# Altium project BEE-1012 PAY-EXP_V100.PrjPcb (part 4 of 4)

## Sheet 17_FLOW_Sensor.SchDoc
size 420 x 297 mm; SheetNumber: 26; SheetTotal: 33
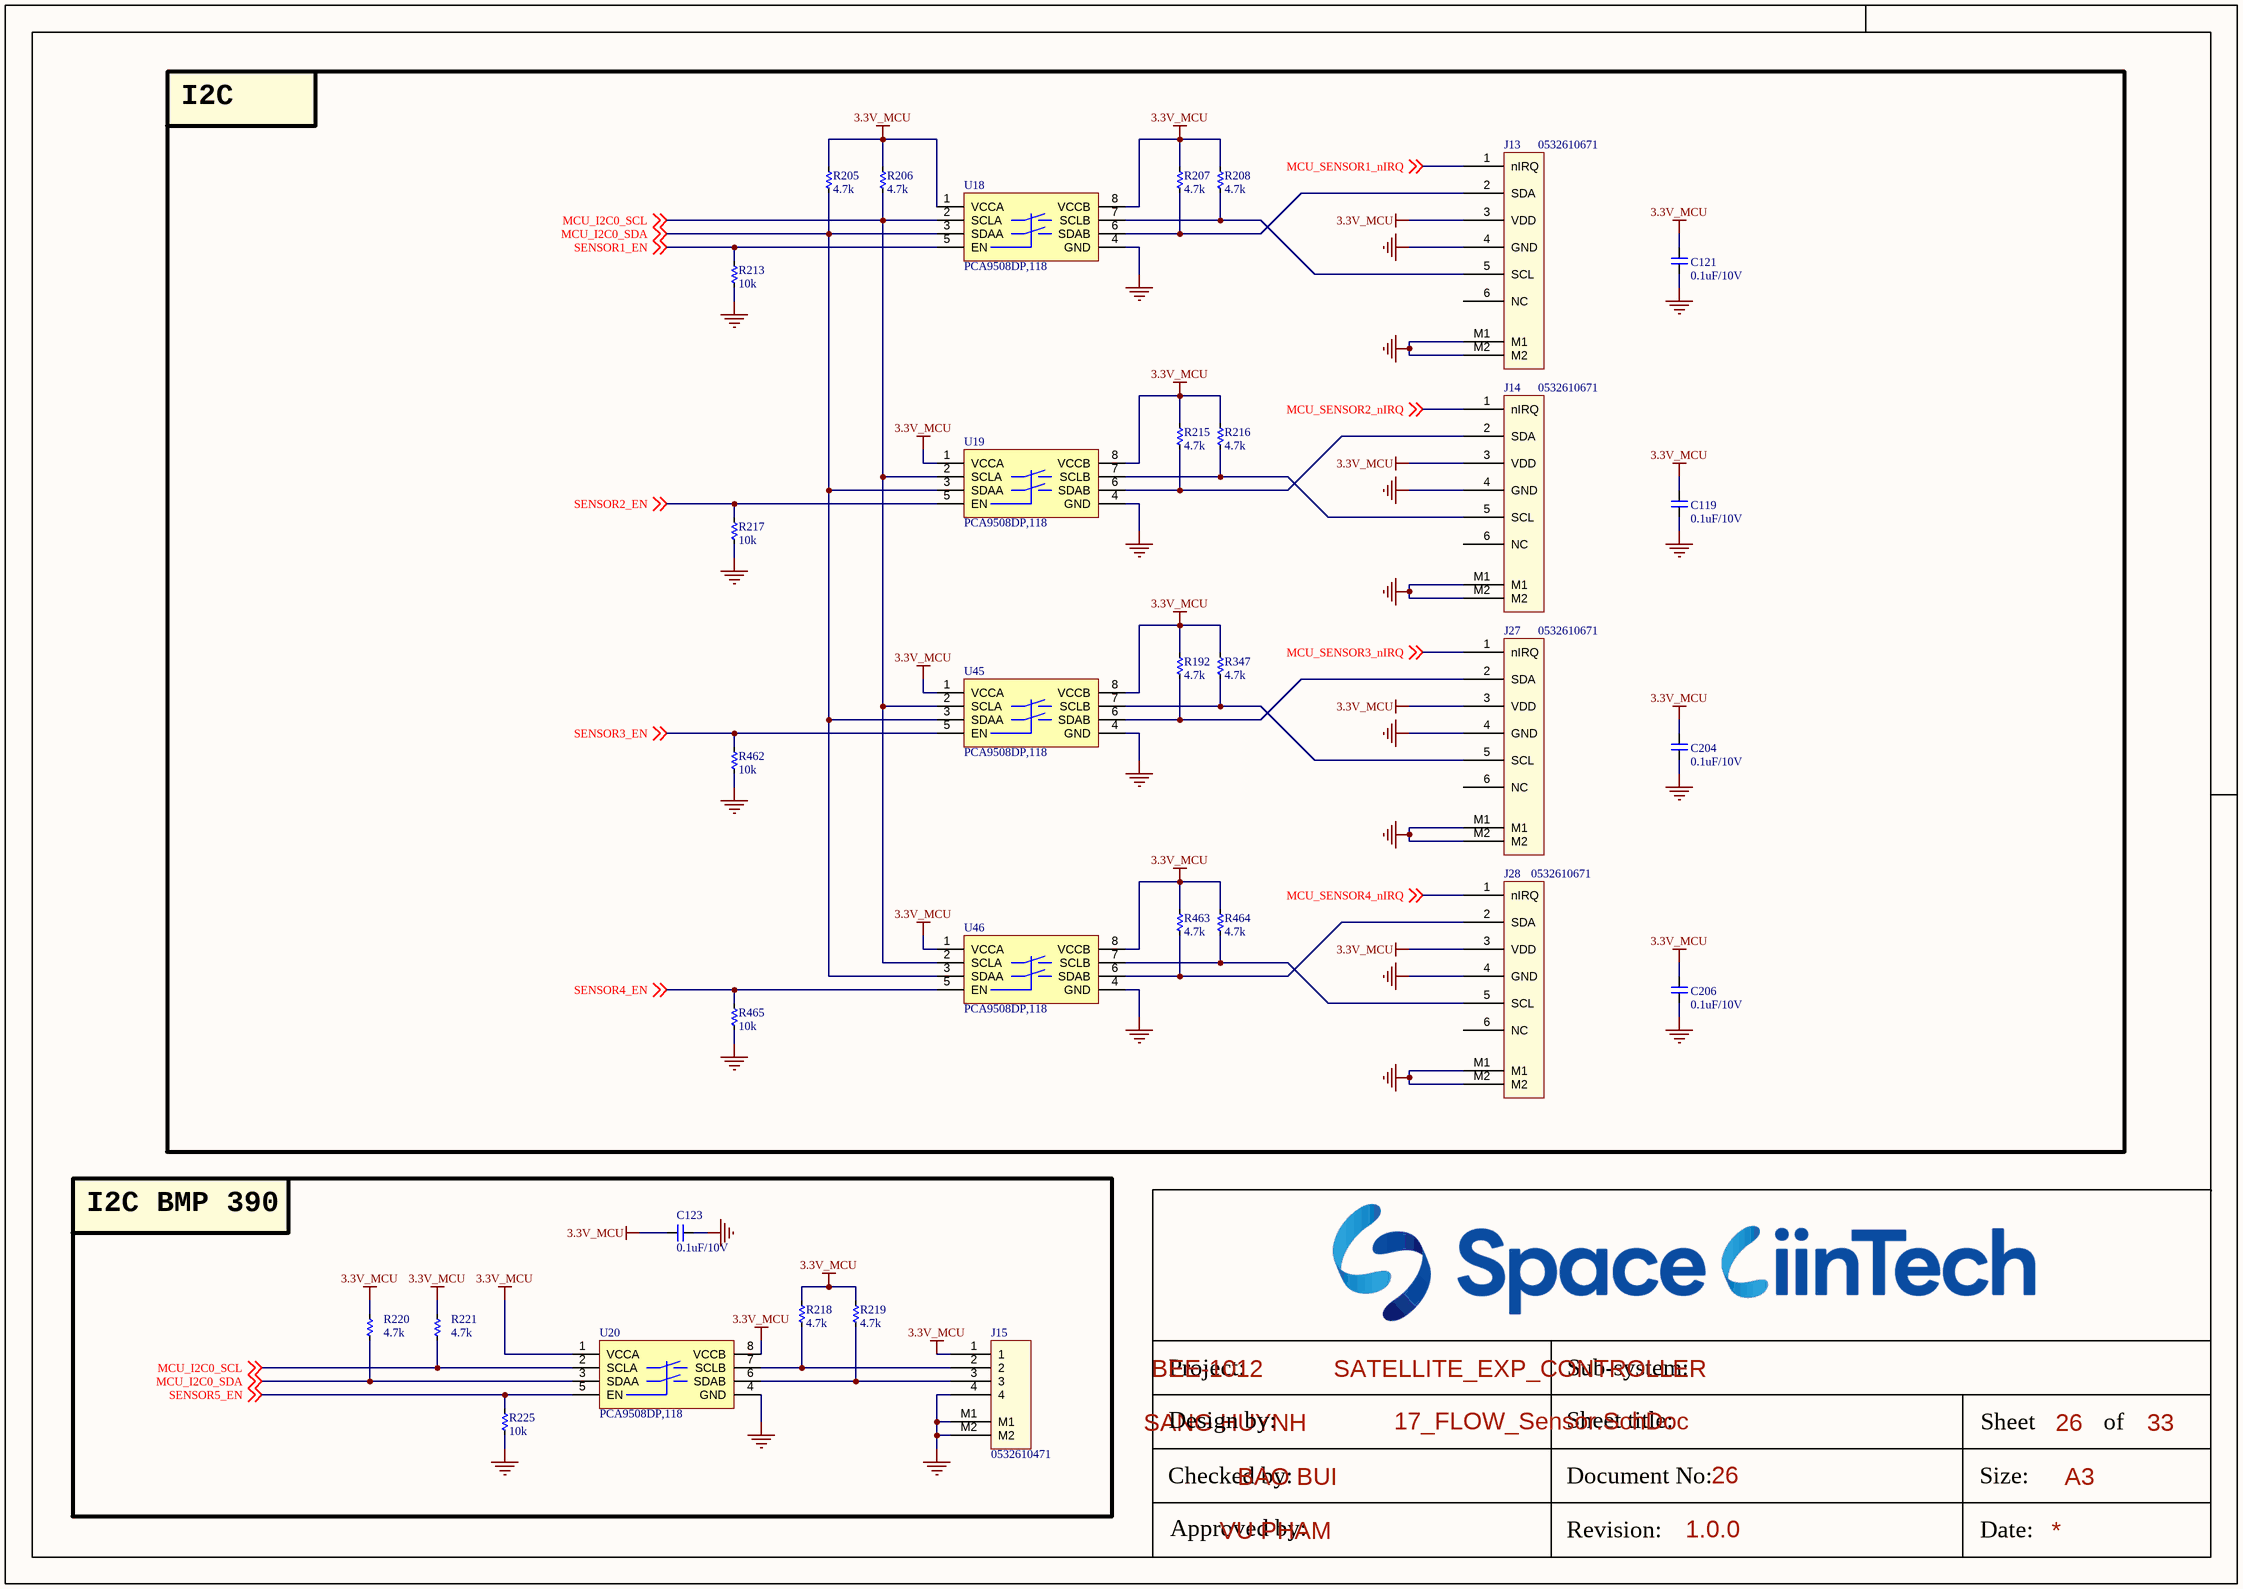
[diagram p30: 17_FLOW_Sensor.SchDoc]

### Parts
(Parts that share a designator on the sheet are numbered #1, #2 ... from top to bottom, then left to right.)
C119  0.1uF/10V  [CAP_C_1005X50_L]
C121  0.1uF/10V  [CAP_C_1005X50_L]
C123  0.1uF/10V  [CAP_C_1005X50_L]
C204  0.1uF/10V  [CAP_C_1005X50_L]
C206  0.1uF/10V  [CAP_C_1005X50_L]
J13  0532610671  [MOLEX_0532610671]
J14  0532610671  [MOLEX_0532610671]
J15  0532610471  [MOLEX_0532610471]
J27  0532610671  [MOLEX_0532610671]
J28  0532610671  [MOLEX_0532610671]
R192#2  4.7k  [RES_C_1005x30_L]
R205#2  4.7k  [RES_C_1005x30_L]
R206  4.7k  [RES_C_1005x30_L]
R207  4.7k  [RES_C_1005x30_L]
R208  4.7k  [RES_C_1005x30_L]
R213  10k  [RES_C_1005x30_L]
R215  4.7k  [RES_C_1005x30_L]
R216  4.7k  [RES_C_1005x30_L]
R217  10k  [RES_C_1005x30_L]
R218  4.7k  [RES_C_1005x30_L]
R219  4.7k  [RES_C_1005x30_L]
R220  4.7k  [RES_C_1005x30_L]
R221  4.7k  [RES_C_1005x30_L]
R225  10k  [RES_C_1005x30_L]
R347  4.7k  [RES_C_1005x30_L]
R462  10k  [RES_C_1005x30_L]
R463  4.7k  [RES_C_1005x30_L]
R464  4.7k  [RES_C_1005x30_L]
R465  10k  [RES_C_1005x30_L]
U18  PCA9508DP,118  [TSOP8]
U19  PCA9508DP,118  [TSOP8]
U20  PCA9508DP,118  [TSOP8]
U45  PCA9508DP,118  [TSOP8]
U46  PCA9508DP,118  [TSOP8]

### Blocks framed on the sheet
I2C: C119 C121 C204 C206 J13 J14 J27 J28 R192#2 R205#2 R206-R208 R213 R215-R217 R347 R462-R465 U18 U19 U45 U46
I2C BMP 390: C123 J15 R218-R221 R225 U20

### Nets
3.3V_MCU: C119.2 C121.2 C123.2 C204.2 C206.2 J13.3(VDD) J14.3(VDD) J15.1 J27.3(VDD) J28.3(VDD) R192#2.1 R205#2.1 R206.1 R207.1 R208.1 R215.1 R216.1 R218.1 R219.1 R220.1 R221.1 R347.1 R463.1 R464.1 U18.1(VCCA) U18.8(VCCB) U19.1(VCCA) U19.8(VCCB) U20.1(VCCA) U20.8(VCCB) U45.1(VCCA) U45.8(VCCB) U46.1(VCCA) U46.8(VCCB)
GND: C119.1 C121.1 C123.1 C204.1 C206.1 J13.4(GND) J13.M1 J13.M2 J14.4(GND) J14.M1 J14.M2 J15.4 J15.M1 J15.M2 J27.4(GND) J27.M1 J27.M2 J28.4(GND) J28.M1 J28.M2 R213.2 R217.2 R225.2 R462.2 R465.2 U18.4(GND) U19.4(GND) U20.4(GND) U45.4(GND) U46.4(GND)
MCU_I2C0_SCL: R206.2 R221.2 U18.2(SCLA) U19.2(SCLA) U20.2(SCLA) U45.2(SCLA) U46.2(SCLA) ; off-sheet MCU_I2C0_SCL
MCU_I2C0_SDA: R205#2.2 R220.2 U18.3(SDAA) U19.3(SDAA) U20.3(SDAA) U45.3(SDAA) U46.3(SDAA) ; off-sheet MCU_I2C0_SDA
MCU_SENSOR1_nIRQ: J13.1(nIRQ) ; off-sheet MCU_SENSOR1_nIRQ
MCU_SENSOR2_nIRQ: J14.1(nIRQ) ; off-sheet MCU_SENSOR2_nIRQ
MCU_SENSOR3_nIRQ: J27.1(nIRQ) ; off-sheet MCU_SENSOR3_nIRQ
MCU_SENSOR4_nIRQ: J28.1(nIRQ) ; off-sheet MCU_SENSOR4_nIRQ
SENSOR1_EN: R213.1 U18.5(EN) ; off-sheet SENSOR1_EN
SENSOR2_EN: R217.1 U19.5(EN) ; off-sheet SENSOR2_EN
SENSOR3_EN: R462.1 U45.5(EN) ; off-sheet SENSOR3_EN
SENSOR4_EN: R465.1 U46.5(EN) ; off-sheet SENSOR4_EN
SENSOR5_EN: R225.1 U20.5(EN) ; off-sheet SENSOR5_EN
NetJ13_2: J13.2(SDA) R207.2 U18.6(SDAB)
NetJ13_5: J13.5(SCL) R208.2 U18.7(SCLB)
NetJ14_2: J14.2(SDA) R215.2 U19.6(SDAB)
NetJ14_5: J14.5(SCL) R216.2 U19.7(SCLB)
NetJ15_2: J15.2 R218.2 U20.7(SCLB)
NetJ15_3: J15.3 R219.2 U20.6(SDAB)
NetJ27_2: J27.2(SDA) R192#2.2 U45.6(SDAB)
NetJ27_5: J27.5(SCL) R347.2 U45.7(SCLB)
NetJ28_2: J28.2(SDA) R463.2 U46.6(SDAB)
NetJ28_5: J28.5(SCL) R464.2 U46.7(SCLB)

Not connected (* = marked no-connect by the designer): J13 6(NC); J14 6(NC); J27 6(NC); J28 6(NC)

### Notes on the sheet
- Project:
- BEE-1012
- Sub-system:
- SATELLITE_EXP_CONTROLLER
- Design by:
- SANG HUYNH
- BAO BUI
- Sheet title:
- Sheet
- A3
- of
- Checked by:
- Approved by:
- VU PHAM
- Revision:
- Document No:
- Size:
- Date:

### Library data of the parts
C119 C121 C123 C204 C206 = _CAP_C_2: CAP
J13 J14 J27 J28 = FLOW_SENSOR
J15 = Header 4x1_2M
R192#2 R205#2 R206-R208 R213 R215-R221 R225 R347 R462-R465 = _RES_B_2: RES

## Sheet 17_I2C_Sensor_OnBoard.SchDoc
size 420 x 297 mm; SheetNumber: 27; SheetTotal: 33
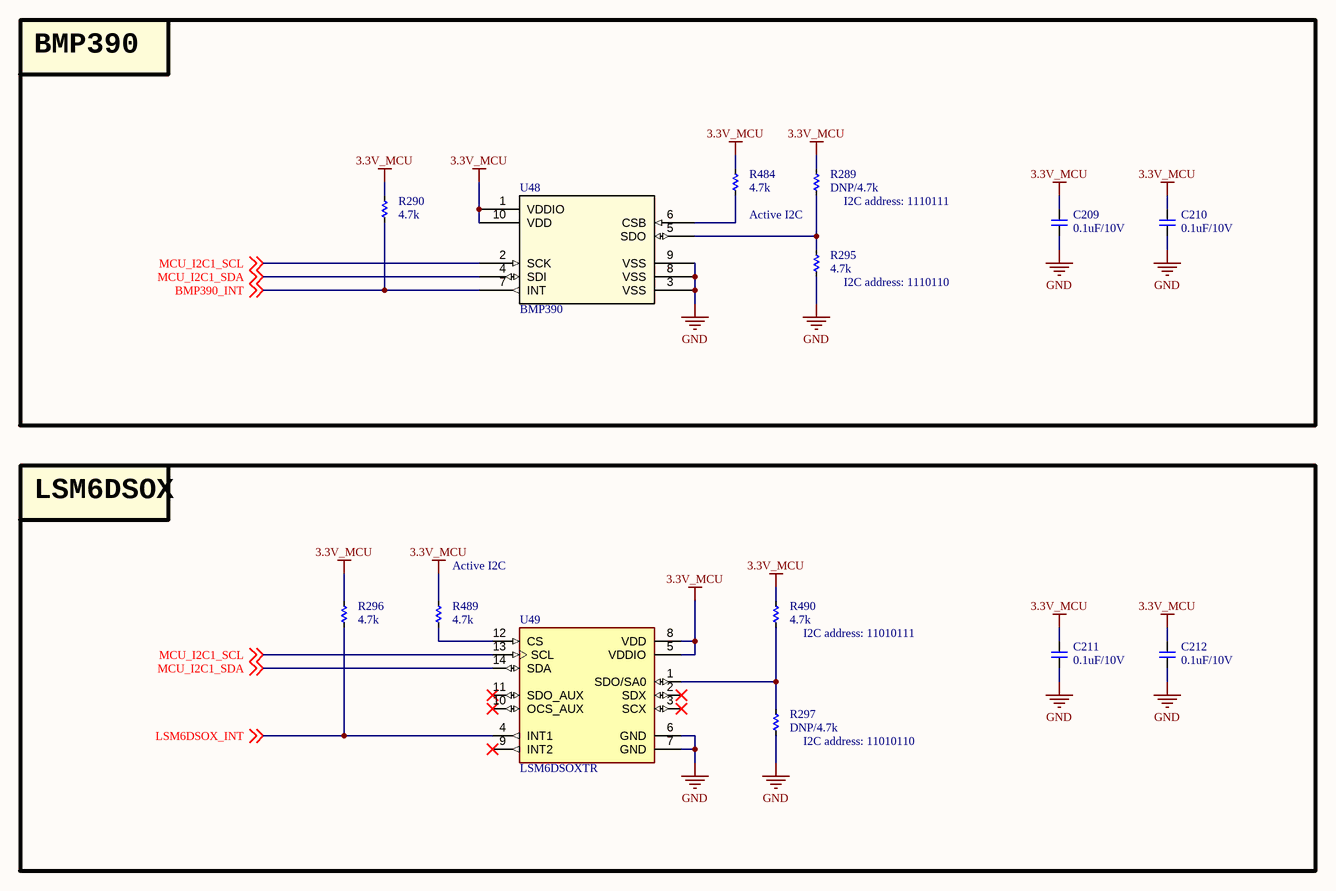
[diagram p31: 17_I2C_Sensor_OnBoard.SchDoc]

### Parts
C209  0.1uF/10V  [CAP_C_1005X50_L]
C210  0.1uF/10V  [CAP_C_1005X50_L]
C211  0.1uF/10V  [CAP_C_1005X50_L]
C212  0.1uF/10V  [CAP_C_1005X50_L]
R289  DNP/4.7k  [RES_C_1005x30_L]
R290  4.7k  [RES_C_0603X30]
R295  4.7k  [RES_C_1005x30_L]
R296  4.7k  [RES_C_1005x30_L]
R297  DNP/4.7k  [RES_C_1005x30_L]
R484  4.7k  [RES_C_1005x30_L]
R489  4.7k  [RES_C_1005x30_L]
R490  4.7k  [RES_C_1005x30_L]
U48  BMP390  [10LGA_2X2X0p75_BOS]
U49  LSM6DSOXTR  [PQFN50P250X300X86-14N]

### Blocks framed on the sheet
BMP390: C209 C210 R289 R290 R295 R484 U48
LSM6DSOX: C211 C212 R296 R297 R489 R490 U49

### Nets
3.3V_MCU: C209.2 C210.2 C211.2 C212.2 R289.1 R290.1 R296.1 R484.1 R489.1 R490.1 U48.1(VDDIO) U48.10(VDD) U49.5(VDDIO) U49.8(VDD)
GND: C209.1 C210.1 C211.1 C212.1 R295.2 R297.2 U48.3(VSS) U48.8(VSS) U48.9(VSS) U49.6(GND) U49.7(GND)
BMP390_INT: R290.2 U48.7(INT) ; off-sheet BMP390_INT
LSM6DSOX_INT: R296.2 U49.4(INT1) ; off-sheet LSM6DSOX_INT
MCU_I2C1_SCL: U48.2(SCK) U49.13(SCL) ; off-sheet MCU_I2C1_SCL
MCU_I2C1_SDA: U48.4(SDI) U49.14(SDA) ; off-sheet MCU_I2C1_SDA
NetR289_2: R289.2 R295.1 U48.5(SDO)
NetR297_1: R297.1 R490.2 U49.1(SDO/SA0)
NetR484_2: R484.2 U48.6(CSB)
NetR489_2: R489.2 U49.12(CS)

Not connected (* = marked no-connect by the designer): U49 2(SDX)* 3(SCX)* 9(INT2)* 10(OCS_AUX)* 11(SDO_AUX)*

### Notes on the sheet
- Active I2C
- (near R289) I2C address: 1110111
- (near R295) I2C address: 1110110
- (near R489) Active I2C
- (near R490) I2C address: 11010111
- (near R297) I2C address: 11010110
- Project:
- BEE-1012
- Sub-system:
- SATELLITE_EXP_CONTROLLER
- Design by:
- SANG HUYNH
- BAO BUI
- Sheet title:
- Sheet
- A3
- of
- Checked by:
- Approved by:
- VU PHAM
- Revision:
- Document No:
- Size:
- Date:

### Library data of the parts
C209-C212 = _CAP_C_2: CAP
R289 R290 R295-R297 R484 R489 R490 = _RES_B_2: RES
U48 = BMP390: Description; Manufacturer_Name: Bosch Sensortec; Copyright: Copyright (C) 2025 Ultra Librarian. All rights reserved.; Manufacturer_Part_Number: BMP390; RefDes: RefDes; Type: Type
U49 = LSM6DSOXTR: Accelerometer, Gyroscope, 6 Axis Sensor I2C, SPI Output; MF: STMicroelectronics; SnapEDA_Link: https://www.snapeda.com/parts/LSM6DSOXTR/STMicroelectronics/view-part/?ref=snap; Package: VFLGA-14 STMicroelectronics; Value: *; MP: LSM6DSOXTR; Check_prices: https://www.snapeda.com/parts/LSM6DSOXTR/STMicroelectronics/view-part/?ref=eda

## Sheet 18_HD4_PUMP.SchDoc
size 420 x 297 mm; SheetNumber: 28; SheetTotal: 33
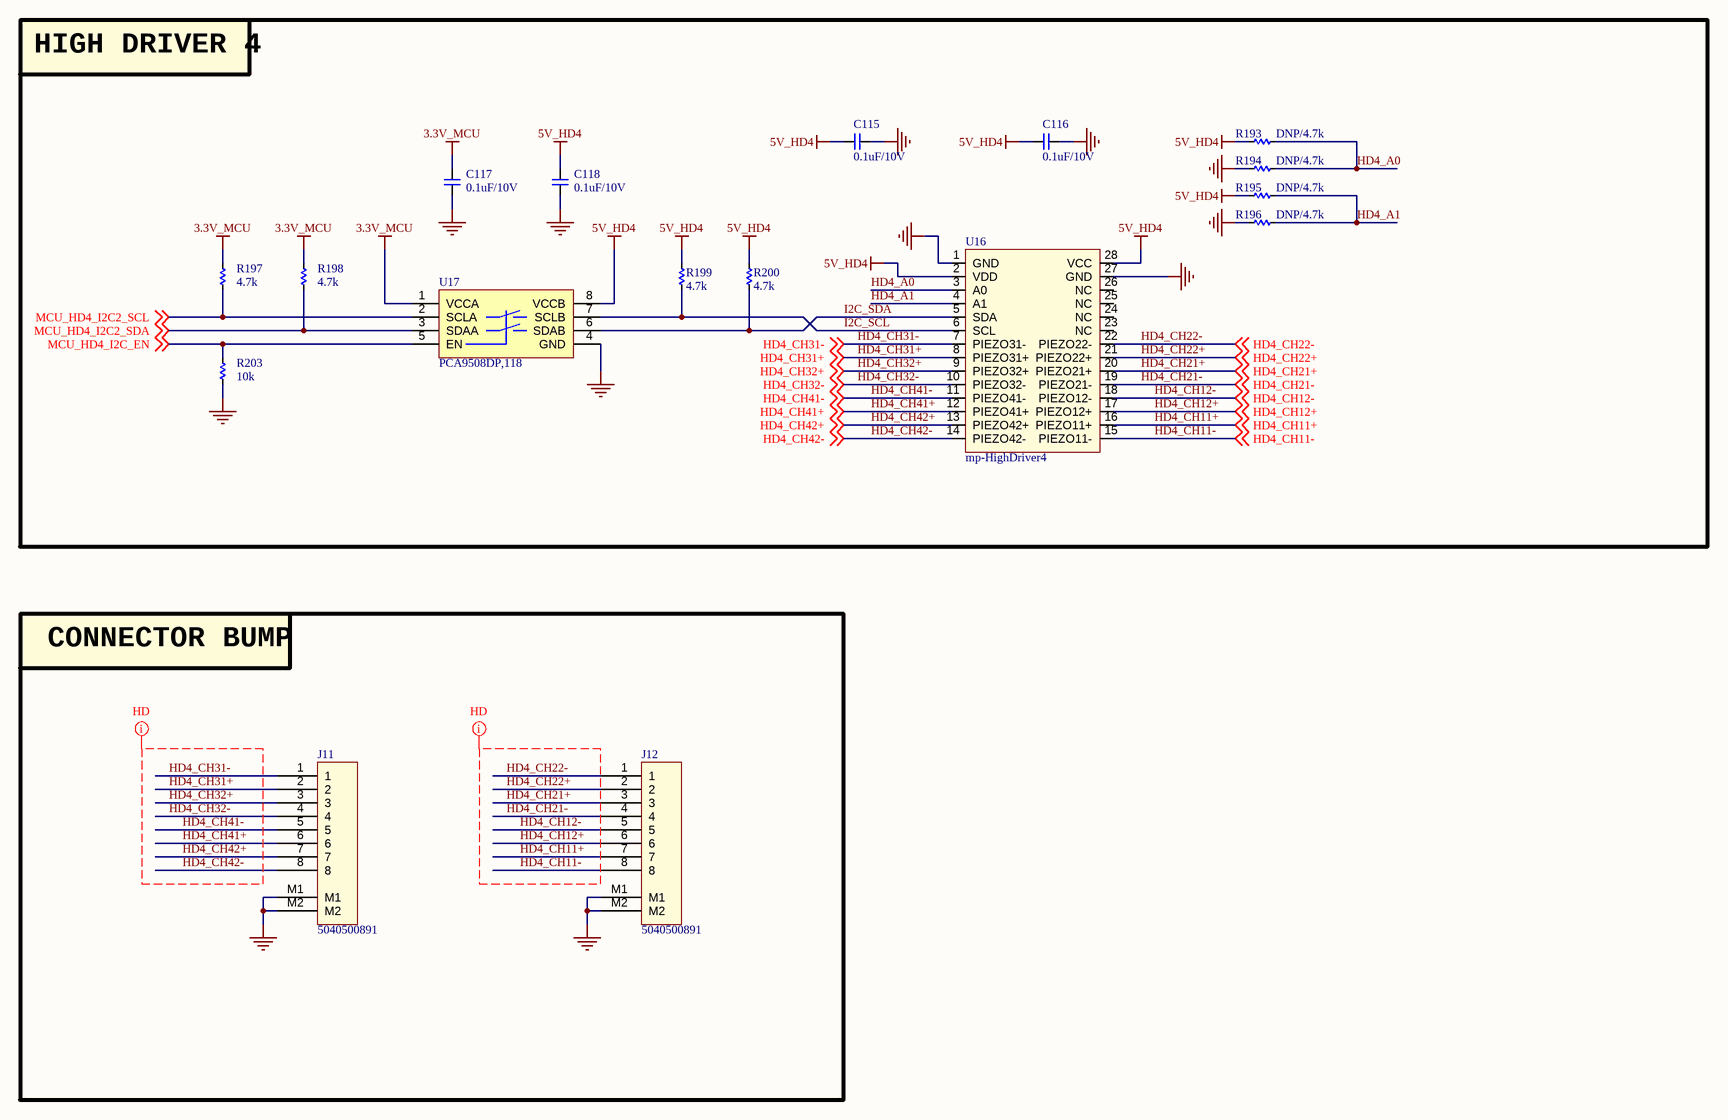
[diagram p32: 18_HD4_PUMP.SchDoc]

### Parts
(Parts that share a designator on the sheet are numbered #1, #2 ... from top to bottom, then left to right.)
C115  0.1uF/10V  [CAP_C_1005X50_L]
C116  0.1uF/10V  [CAP_C_1005X50_L]
C117  0.1uF/10V  [CAP_C_1005X50_L]
C118  0.1uF/10V  [CAP_C_1005X50_L]
J11  5040500891  [MOLEX_5040500891]
J12  5040500891  [MOLEX_5040500891]
R193#2  DNP/4.7k  [RES_C_1005x30_L]
R194#2  DNP/4.7k  [RES_C_1005x30_L]
R195#2  DNP/4.7k  [RES_C_1005x30_L]
R196#2  DNP/4.7k  [RES_C_1005x30_L]
R197#2  4.7k  [RES_C_1005x30_L]
R198#2  4.7k  [RES_C_1005x30_L]
R199#2  4.7k  [RES_C_1005x30_L]
R200#2  4.7k  [RES_C_1005x30_L]
R203#2  10k  [RES_C_1005x30_L]
U16  mp-HighDriver4  [MP_HIGHDRIVER4]
U17  PCA9508DP,118  [TSOP8]

### Blocks framed on the sheet
HIGH DRIVER 4: C115-C118 R193#2 R194#2 R195#2 R196#2 R197#2 R198#2 R199#2 R200#2 R203#2 U16 U17
CONNECTOR BUMP: J11 J12

### Nets
3.3V_MCU: C117.2 R197#2.1 R198#2.1 U17.1(VCCA)
5V_HD4: C115.2 C116.2 C118.2 R193#2.1 R195#2.1 R199#2.1 R200#2.1 U16.2(VDD) U16.28(VCC) U17.8(VCCB)
GND: C115.1 C116.1 C117.1 C118.1 J11.M1 J11.M2 J12.M1 J12.M2 R194#2.1 R196#2.1 R203#2.2 U16.1(GND) U16.27(GND) U17.4(GND)
HD4_A0: R193#2.2 R194#2.2 U16.3(A0)
HD4_A1: R195#2.2 R196#2.2 U16.4(A1)
HD4_CH11+: J12.7 U16.16(PIEZO11+) ; off-sheet HD4_CH11+
HD4_CH11-: J12.8 U16.15(PIEZO11-) ; off-sheet HD4_CH11-
HD4_CH12+: J12.6 U16.17(PIEZO12+) ; off-sheet HD4_CH12+
HD4_CH12-: J12.5 U16.18(PIEZO12-) ; off-sheet HD4_CH12-
HD4_CH21+: J12.3 U16.20(PIEZO21+) ; off-sheet HD4_CH21+
HD4_CH21-: J12.4 U16.19(PIEZO21-) ; off-sheet HD4_CH21-
HD4_CH22+: J12.2 U16.21(PIEZO22+) ; off-sheet HD4_CH22+
HD4_CH22-: J12.1 U16.22(PIEZO22-) ; off-sheet HD4_CH22-
HD4_CH31+: J11.2 U16.8(PIEZO31+) ; off-sheet HD4_CH31+
HD4_CH31-: J11.1 U16.7(PIEZO31-) ; off-sheet HD4_CH31-
HD4_CH32+: J11.3 U16.9(PIEZO32+) ; off-sheet HD4_CH32+
HD4_CH32-: J11.4 U16.10(PIEZO32-) ; off-sheet HD4_CH32-
HD4_CH41+: J11.6 U16.12(PIEZO41+) ; off-sheet HD4_CH41+
HD4_CH41-: J11.5 U16.11(PIEZO41-) ; off-sheet HD4_CH41-
HD4_CH42+: J11.7 U16.13(PIEZO42+) ; off-sheet HD4_CH42+
HD4_CH42-: J11.8 U16.14(PIEZO42-) ; off-sheet HD4_CH42-
I2C_SCL: R199#2.2 U16.6(SCL) U17.7(SCLB)
I2C_SDA: R200#2.2 U16.5(SDA) U17.6(SDAB)
MCU_HD4_I2C2_SCL: R197#2.2 U17.2(SCLA) ; off-sheet MCU_HD4_I2C2_SCL
MCU_HD4_I2C2_SDA: R198#2.2 U17.3(SDAA) ; off-sheet MCU_HD4_I2C2_SDA
MCU_HD4_I2C_EN: R203#2.1 U17.5(EN) ; off-sheet MCU_HD4_I2C_EN

Not connected (* = marked no-connect by the designer): U16 23(NC) 24(NC) 25(NC) 26(NC)

### Layout directives
net class HD: HD4_CH11+, HD4_CH11-, HD4_CH12+, HD4_CH12-, HD4_CH21+, HD4_CH21-, HD4_CH22+, HD4_CH22-, HD4_CH31+, HD4_CH31-, HD4_CH32+, HD4_CH32-, HD4_CH41+, HD4_CH41-, HD4_CH42+, HD4_CH42-

### Notes on the sheet
- Project:
- BEE-1012
- Sub-system:
- SATELLITE_EXP_CONTROLLER
- Design by:
- SANG HUYNH
- BAO BUI
- Sheet title:
- Sheet
- A3
- of
- Checked by:
- Approved by:
- VU PHAM
- Revision:
- Document No:
- Size:
- Date:

### Library data of the parts
C115-C118 = _CAP_C_2: CAP
J11 J12 = Header 8x1_2M
R193#2 R194#2 R195#2 R196#2 R197#2 R198#2 R199#2 R200#2 R203#2 = _RES_B_2: RES
U16 = mp_HighDriver4

## Sheet 18_HD4_PUMP_2.SchDoc
size 420 x 297 mm; SheetNumber: 29; SheetTotal: 33
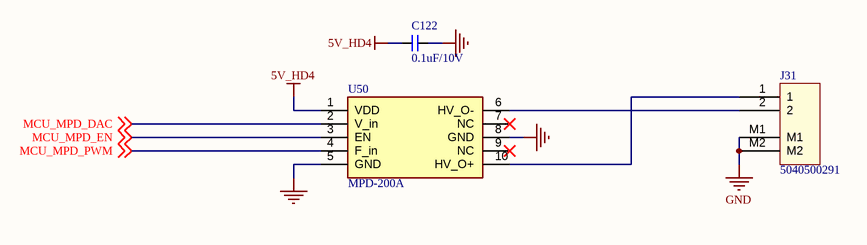
[diagram p33: 18_HD4_PUMP_2.SchDoc]

### Parts
C122  0.1uF/10V  [CAP_C_1005X50_L]
J31  5040500291  [MOLEX_5040500291]
U50  MPD-200A  [MPD-200a]

### Nets
5V_HD4: C122.2 U50.1(VDD)
GND: C122.1 J31.M1 J31.M2 U50.5(GND) U50.8(GND)
MCU_MPD_DAC: U50.2(V_in) ; off-sheet MCU_MPD_DAC
MCU_MPD_EN: U50.3(EN) ; off-sheet MCU_MPD_EN
MCU_MPD_PWM: U50.4(F_in) ; off-sheet MCU_MPD_PWM
NetJ31_1: J31.1 U50.10(HV_O+)
NetJ31_2: J31.2 U50.6(HV_O-)

Not connected (* = marked no-connect by the designer): U50 7(NC)* 9(NC)*

### Notes on the sheet
- Project:
- BEE-1012
- Sub-system:
- SATELLITE_EXP_CONTROLLER
- Design by:
- SANG HUYNH
- BAO BUI
- Sheet title:
- Sheet
- A3
- of
- Checked by:
- Approved by:
- VU PHAM
- Revision:
- Document No:
- Size:
- Date:

### Library data of the parts
C122 = _CAP_C_2: CAP
J31 = Header 2x1_2M

## Sheet 19_SOLEDNOID_1.SchDoc
size 420 x 297 mm; SheetNumber: 30; SheetTotal: 33
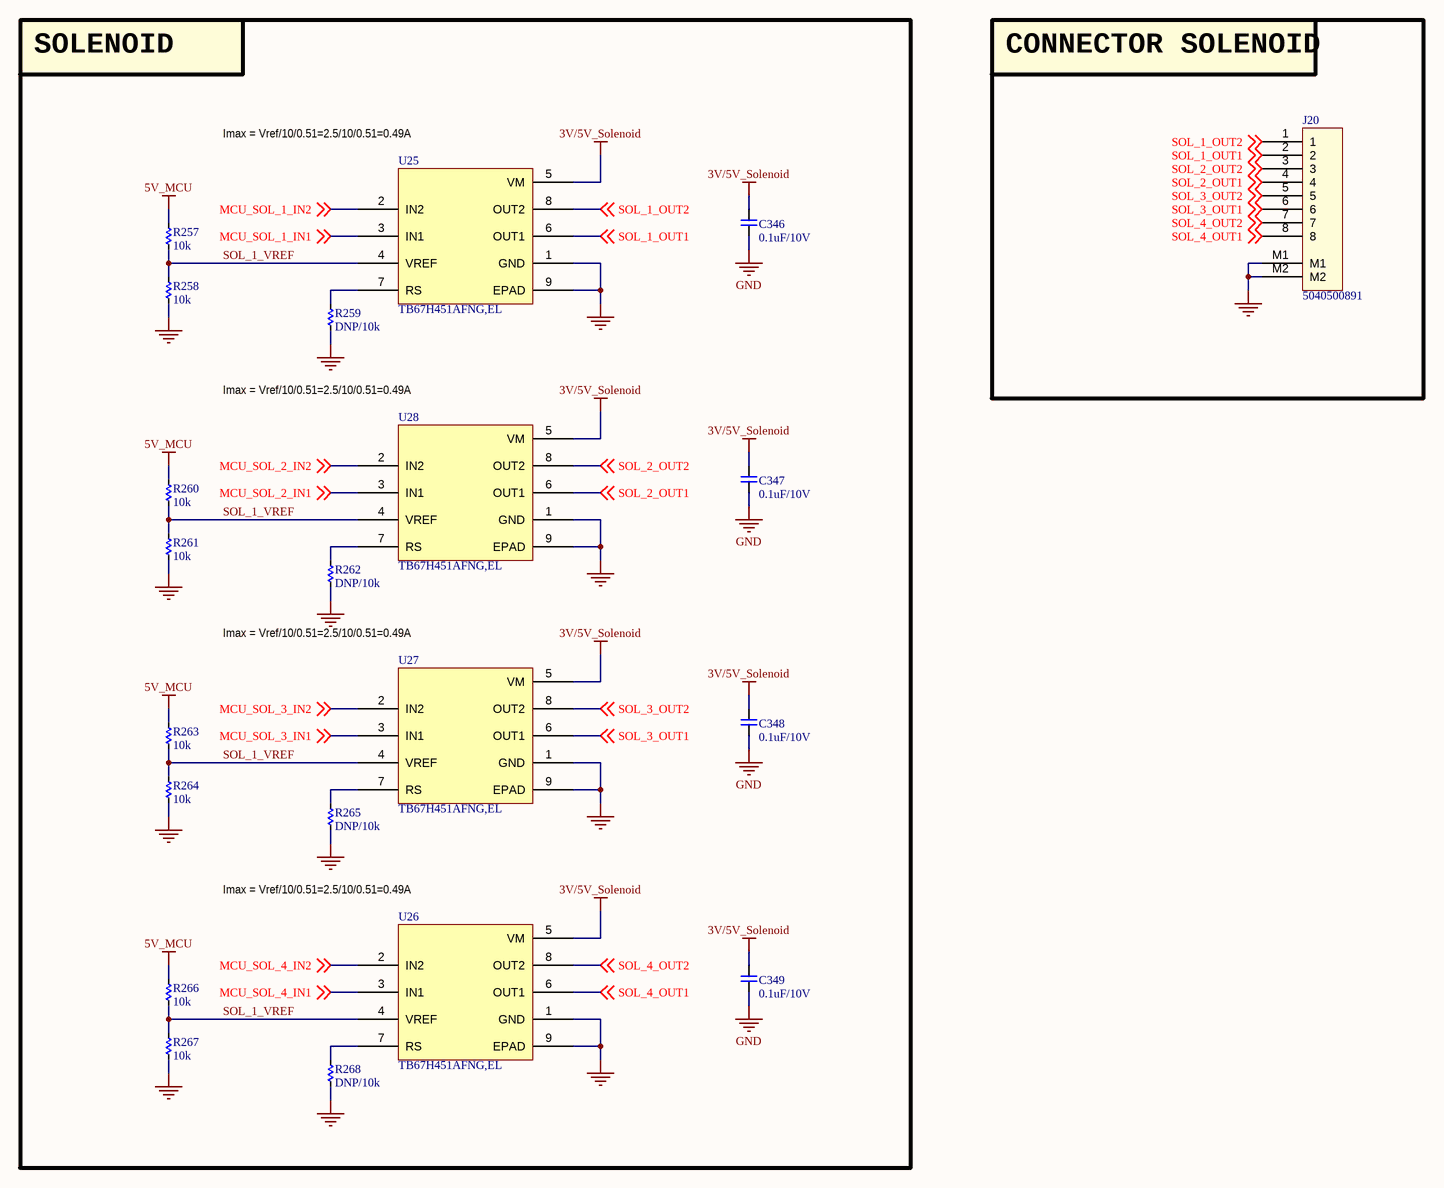
[diagram p34: 19_SOLEDNOID_1.SchDoc]

### Parts
(Parts that share a designator on the sheet are numbered #1, #2 ... from top to bottom, then left to right.)
C346  0.1uF/10V  [CAP_C_1005X50_L]
C347  0.1uF/10V  [CAP_C_1005X50_L]
C348  0.1uF/10V  [CAP_C_1005X50_L]
C349  0.1uF/10V  [CAP_C_1005X50_L]
J20  5040500891  [MOLEX_5040500891]
R257  10k  [RES_C_1005x30_L]
R258  10k  [RES_C_1005x30_L]
R259  DNP/10k  [RES_C_1005x30_L]
R260  10k  [RES_C_1005x30_L]
R261  10k  [RES_C_1005x30_L]
R262  DNP/10k  [RES_C_1005x30_L]
R263  10k  [RES_C_1005x30_L]
R264  10k  [RES_C_1005x30_L]
R265  DNP/10k  [RES_C_1005x30_L]
R266  10k  [RES_C_1005x30_L]
R267  10k  [RES_C_1005x30_L]
R268  DNP/10k  [RES_C_1005x30_L]
U25#2  TB67H451AFNG,EL  [SOIC127P602X173-8N_EPAD]
U26#2  TB67H451AFNG,EL  [SOIC127P602X173-8N_EPAD]
U27#2  TB67H451AFNG,EL  [SOIC127P602X173-8N_EPAD]
U28#2  TB67H451AFNG,EL  [SOIC127P602X173-8N_EPAD]

### Blocks framed on the sheet
SOLENOID: C346-C349 R257-R268 U25#2 U26#2 U27#2 U28#2
CONNECTOR SOLENOID: J20

### Nets
3V/5V_Solenoid: C346.2 C347.2 C348.2 C349.2 U25#2.5(VM) U26#2.5(VM) U27#2.5(VM) U28#2.5(VM)
5V_MCU: R257.1 R260.1 R263.1 R266.1
GND: C346.1 C347.1 C348.1 C349.1 J20.M1 J20.M2 R258.2 R259.2 R261.2 R262.2 R264.2 R265.2 R267.2 R268.2 U25#2.1(GND) U25#2.9(EPAD) U26#2.1(GND) U26#2.9(EPAD) U27#2.1(GND) U27#2.9(EPAD) U28#2.1(GND) U28#2.9(EPAD)
MCU_SOL_1_IN1: U25#2.3(IN1) ; off-sheet MCU_SOL_1_IN1
MCU_SOL_1_IN2: U25#2.2(IN2) ; off-sheet MCU_SOL_1_IN2
MCU_SOL_2_IN1: U28#2.3(IN1) ; off-sheet MCU_SOL_2_IN1
MCU_SOL_2_IN2: U28#2.2(IN2) ; off-sheet MCU_SOL_2_IN2
MCU_SOL_3_IN1: U27#2.3(IN1) ; off-sheet MCU_SOL_3_IN1
MCU_SOL_3_IN2: U27#2.2(IN2) ; off-sheet MCU_SOL_3_IN2
MCU_SOL_4_IN1: U26#2.3(IN1) ; off-sheet MCU_SOL_4_IN1
MCU_SOL_4_IN2: U26#2.2(IN2) ; off-sheet MCU_SOL_4_IN2
SOL_1_OUT1: J20.2 U25#2.6(OUT1) ; off-sheet SOL_1_OUT1
SOL_1_OUT2: J20.1 U25#2.8(OUT2) ; off-sheet SOL_1_OUT2
SOL_1_VREF: R257.2 R258.1 R260.2 R261.1 R263.2 R264.1 R266.2 R267.1 U25#2.4(VREF) U26#2.4(VREF) U27#2.4(VREF) U28#2.4(VREF)
SOL_2_OUT1: J20.4 U28#2.6(OUT1) ; off-sheet SOL_2_OUT1
SOL_2_OUT2: J20.3 U28#2.8(OUT2) ; off-sheet SOL_2_OUT2
SOL_3_OUT1: J20.6 U27#2.6(OUT1) ; off-sheet SOL_3_OUT1
SOL_3_OUT2: J20.5 U27#2.8(OUT2) ; off-sheet SOL_3_OUT2
SOL_4_OUT1: J20.8 U26#2.6(OUT1) ; off-sheet SOL_4_OUT1
SOL_4_OUT2: J20.7 U26#2.8(OUT2) ; off-sheet SOL_4_OUT2
NetR259_1: R259.1 U25#2.7(RS)
NetR262_1: R262.1 U28#2.7(RS)
NetR265_1: R265.1 U27#2.7(RS)
NetR268_1: R268.1 U26#2.7(RS)

### Notes on the sheet
- (near U25#2) Imax = Vref/10/0.51=2.5/10/0.51=0.49A
- Imax = Vref/10/0.51=2.5/10/0.51=0.49A
- Project:
- BEE-1012
- Sub-system:
- SATELLITE_EXP_CONTROLLER
- Design by:
- SANG HUYNH
- BAO BUI
- Sheet title:
- Sheet
- A3
- of
- Checked by:
- Approved by:
- VU PHAM
- Revision:
- Document No:
- Size:
- Date:

### Library data of the parts
C346-C349 = _CAP_C_2: CAP CHIP
J20 = Header 8x1_2M
R257-R268 = _RES_B_2: RES
U25#2 U26#2 U27#2 U28#2 = IC_H_bridge_TB67H451AFNG,EL: BRUSHED MOTOR DRIVER IC, 50V, 3.

## Sheet 19_SOLEDNOID_2.SchDoc
size 420 x 297 mm; SheetNumber: 31; SheetTotal: 33
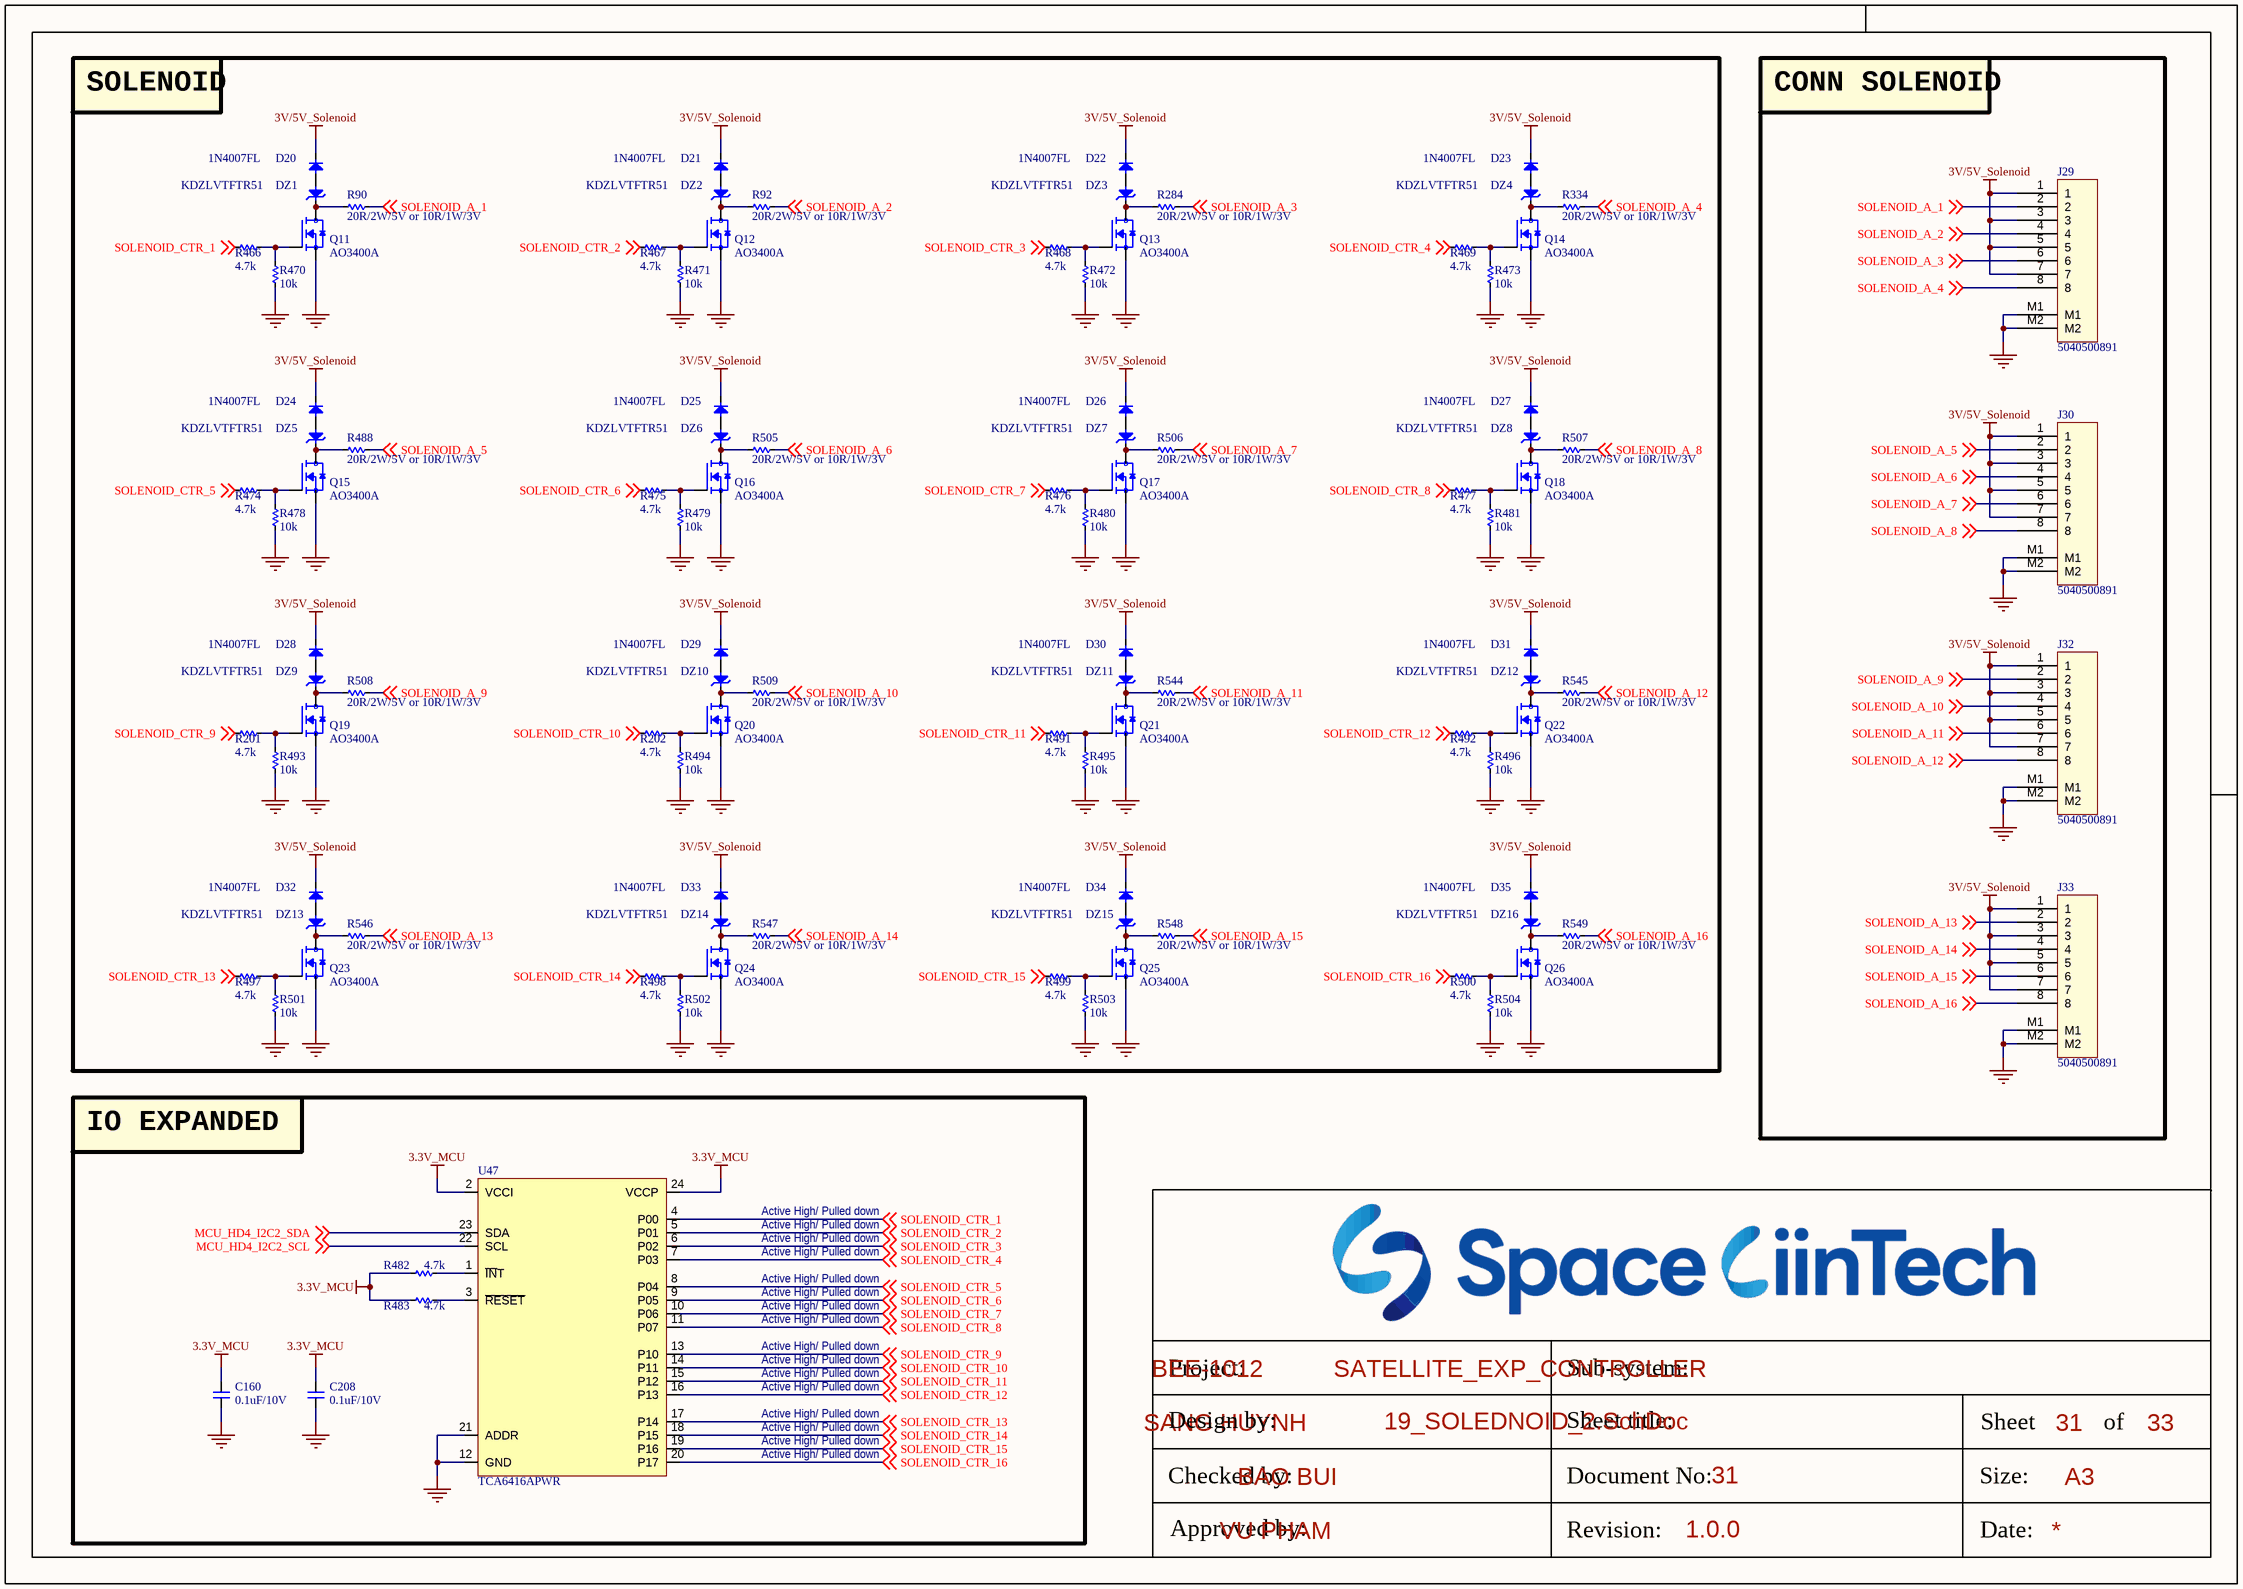
[diagram p35: 19_SOLEDNOID_2.SchDoc]

### Parts
(Parts that share a designator on the sheet are numbered #1, #2 ... from top to bottom, then left to right.)
C160#2  0.1uF/10V  [CAP_C_1005X50_L]
C208  0.1uF/10V  [CAP_C_1005X50_L]
D20  1N4007FL  [SOD3717X145N]
D21  1N4007FL  [SOD3717X145N]
D22  1N4007FL  [SOD3717X145N]
D23  1N4007FL  [SOD3717X145N]
D24  1N4007FL  [SOD3717X145N]
D25  1N4007FL  [SOD3717X145N]
D26  1N4007FL  [SOD3717X145N]
D27  1N4007FL  [SOD3717X145N]
D28  1N4007FL  [SOD3717X145N]
D29  1N4007FL  [SOD3717X145N]
D30  1N4007FL  [SOD3717X145N]
D31  1N4007FL  [SOD3717X145N]
D32  1N4007FL  [SOD3717X145N]
D33  1N4007FL  [SOD3717X145N]
D34  1N4007FL  [SOD3717X145N]
D35  1N4007FL  [SOD3717X145N]
DZ1  KDZLVTFTR51  [SOD3717X145N]
DZ2  KDZLVTFTR51  [SOD3717X145N]
DZ3  KDZLVTFTR51  [SOD3717X145N]
DZ4  KDZLVTFTR51  [SOD3717X145N]
DZ5  KDZLVTFTR51  [SOD3717X145N]
DZ6  KDZLVTFTR51  [SOD3717X145N]
DZ7  KDZLVTFTR51  [SOD3717X145N]
DZ8  KDZLVTFTR51  [SOD3717X145N]
DZ9  KDZLVTFTR51  [SOD3717X145N]
DZ10  KDZLVTFTR51  [SOD3717X145N]
DZ11  KDZLVTFTR51  [SOD3717X145N]
DZ12  KDZLVTFTR51  [SOD3717X145N]
DZ13  KDZLVTFTR51  [SOD3717X145N]
DZ14  KDZLVTFTR51  [SOD3717X145N]
DZ15  KDZLVTFTR51  [SOD3717X145N]
DZ16  KDZLVTFTR51  [SOD3717X145N]
J29  5040500891  [MOLEX_5040500891]
J30  5040500891  [MOLEX_5040500891]
J32  5040500891  [MOLEX_5040500891]
J33  5040500891  [MOLEX_5040500891]
Q11  AO3400A  [SOT95P240X120-3N]
Q12  AO3400A  [SOT95P240X120-3N]
Q13  AO3400A  [SOT95P240X120-3N]
Q14  AO3400A  [SOT95P240X120-3N]
Q15  AO3400A  [SOT95P240X120-3N]
Q16  AO3400A  [SOT95P240X120-3N]
Q17  AO3400A  [SOT95P240X120-3N]
Q18  AO3400A  [SOT95P240X120-3N]
Q19  AO3400A  [SOT95P240X120-3N]
Q20  AO3400A  [SOT95P240X120-3N]
Q21  AO3400A  [SOT95P240X120-3N]
Q22  AO3400A  [SOT95P240X120-3N]
Q23  AO3400A  [SOT95P240X120-3N]
Q24  AO3400A  [SOT95P240X120-3N]
Q25  AO3400A  [SOT95P240X120-3N]
Q26  AO3400A  [SOT95P240X120-3N]
R90  20R/2W/5V or 10R/1W/3V  [RES_C_6331X65_N]
R92  20R/2W/5V or 10R/1W/3V  [RES_C_6331X65_N]
R201#2  4.7k  [RES_C_1005x30_L]
R202#2  4.7k  [RES_C_1005x30_L]
R284  20R/2W/5V or 10R/1W/3V  [RES_C_6331X65_N]
R334  20R/2W/5V or 10R/1W/3V  [RES_C_6331X65_N]
R466  4.7k  [RES_C_1005x30_L]
R467  4.7k  [RES_C_1005x30_L]
R468  4.7k  [RES_C_1005x30_L]
R469  4.7k  [RES_C_1005x30_L]
R470  10k  [RES_C_1005x30_L]
R471  10k  [RES_C_1005x30_L]
R472  10k  [RES_C_1005x30_L]
R473  10k  [RES_C_1005x30_L]
R474  4.7k  [RES_C_1005x30_L]
R475  4.7k  [RES_C_1005x30_L]
R476  4.7k  [RES_C_1005x30_L]
R477  4.7k  [RES_C_1005x30_L]
R478  10k  [RES_C_1005x30_L]
R479  10k  [RES_C_1005x30_L]
R480  10k  [RES_C_1005x30_L]
R481  10k  [RES_C_1005x30_L]
R482  4.7k  [RES_C_1005x30_L]
R483  4.7k  [RES_C_1005x30_L]
R488  20R/2W/5V or 10R/1W/3V  [RES_C_6331X65_N]
R491  4.7k  [RES_C_1005x30_L]
R492  4.7k  [RES_C_1005x30_L]
R493  10k  [RES_C_1005x30_L]
R494  10k  [RES_C_1005x30_L]
R495  10k  [RES_C_1005x30_L]
R496  10k  [RES_C_1005x30_L]
R497  4.7k  [RES_C_1005x30_L]
R498  4.7k  [RES_C_1005x30_L]
R499  4.7k  [RES_C_1005x30_L]
R500  4.7k  [RES_C_1005x30_L]
R501  10k  [RES_C_1005x30_L]
R502  10k  [RES_C_1005x30_L]
R503  10k  [RES_C_1005x30_L]
R504  10k  [RES_C_1005x30_L]
R505  20R/2W/5V or 10R/1W/3V  [RES_C_6331X65_N]
R506  20R/2W/5V or 10R/1W/3V  [RES_C_6331X65_N]
R507  20R/2W/5V or 10R/1W/3V  [RES_C_6331X65_N]
R508  20R/2W/5V or 10R/1W/3V  [RES_C_6331X65_N]
R509  20R/2W/5V or 10R/1W/3V  [RES_C_6331X65_N]
R544  20R/2W/5V or 10R/1W/3V  [RES_C_6331X65_N]
R545  20R/2W/5V or 10R/1W/3V  [RES_C_6331X65_N]
R546  20R/2W/5V or 10R/1W/3V  [RES_C_6331X65_N]
R547  20R/2W/5V or 10R/1W/3V  [RES_C_6331X65_N]
R548  20R/2W/5V or 10R/1W/3V  [RES_C_6331X65_N]
R549  20R/2W/5V or 10R/1W/3V  [RES_C_6331X65_N]
U47  TCA6416APWR  [SOP65P440W-24N]

### Blocks framed on the sheet
SOLENOID: D20-D35 DZ1-DZ16 Q11-Q26 R90 R92 R201#2 R202#2 R284 R334 R466-R481 R488 R491-R509 R544-R549
CONN SOLENOID: J29 J30 J32 J33
IO EXPANDED: C160#2 C208 R482 R483 U47

### Nets
3.3V_MCU: C160#2.2 C208.2 R482.1 R483.1 U47.2(VCCI) U47.24(VCCP)
3V/5V_Solenoid: D20.1(K) D21.1(K) D22.1(K) D23.1(K) D24.1(K) D25.1(K) D26.1(K) D27.1(K) D28.1(K) D29.1(K) D30.1(K) D31.1(K) D32.1(K) D33.1(K) D34.1(K) D35.1(K) J29.1 J29.3 J29.5 J29.7 J30.1 J30.3 J30.5 J30.7 J32.1 J32.3 J32.5 J32.7 J33.1 J33.3 J33.5 J33.7
GND: C160#2.1 C208.1 J29.M1 J29.M2 J30.M1 J30.M2 J32.M1 J32.M2 J33.M1 J33.M2 Q11.2(S) Q12.2(S) Q13.2(S) Q14.2(S) Q15.2(S) Q16.2(S) Q17.2(S) Q18.2(S) Q19.2(S) Q20.2(S) Q21.2(S) Q22.2(S) Q23.2(S) Q24.2(S) Q25.2(S) Q26.2(S) R470.1 R471.1 R472.1 R473.1 R478.1 R479.1 R480.1 R481.1 R493.1 R494.1 R495.1 R496.1 R501.1 R502.1 R503.1 R504.1 U47.12(GND) U47.21(ADDR)
MCU_HD4_I2C2_SCL: U47.22(SCL) ; off-sheet MCU_HD4_I2C2_SCL
MCU_HD4_I2C2_SDA: U47.23(SDA) ; off-sheet MCU_HD4_I2C2_SDA
SOLENOID_A_1: J29.2 R90.1 ; off-sheet SOLENOID_A_1
SOLENOID_A_2: J29.4 R92.1 ; off-sheet SOLENOID_A_2
SOLENOID_A_3: J29.6 R284.1 ; off-sheet SOLENOID_A_3
SOLENOID_A_4: J29.8 R334.1 ; off-sheet SOLENOID_A_4
SOLENOID_A_5: J30.2 R488.1 ; off-sheet SOLENOID_A_5
SOLENOID_A_6: J30.4 R505.1 ; off-sheet SOLENOID_A_6
SOLENOID_A_7: J30.6 R506.1 ; off-sheet SOLENOID_A_7
SOLENOID_A_8: J30.8 R507.1 ; off-sheet SOLENOID_A_8
SOLENOID_A_9: J32.2 R508.1 ; off-sheet SOLENOID_A_9
SOLENOID_A_10: J32.4 R509.1 ; off-sheet SOLENOID_A_10
SOLENOID_A_11: J32.6 R544.1 ; off-sheet SOLENOID_A_11
SOLENOID_A_12: J32.8 R545.1 ; off-sheet SOLENOID_A_12
SOLENOID_A_13: J33.2 R546.1 ; off-sheet SOLENOID_A_13
SOLENOID_A_14: J33.4 R547.1 ; off-sheet SOLENOID_A_14
SOLENOID_A_15: J33.6 R548.1 ; off-sheet SOLENOID_A_15
SOLENOID_A_16: J33.8 R549.1 ; off-sheet SOLENOID_A_16
SOLENOID_CTR_1: R466.2 U47.4(P00) ; off-sheet SOLENOID_CTR_1
SOLENOID_CTR_2: R467.2 U47.5(P01) ; off-sheet SOLENOID_CTR_2
SOLENOID_CTR_3: R468.2 U47.6(P02) ; off-sheet SOLENOID_CTR_3
SOLENOID_CTR_4: R469.2 U47.7(P03) ; off-sheet SOLENOID_CTR_4
SOLENOID_CTR_5: R474.2 U47.8(P04) ; off-sheet SOLENOID_CTR_5
SOLENOID_CTR_6: R475.2 U47.9(P05) ; off-sheet SOLENOID_CTR_6
SOLENOID_CTR_7: R476.2 U47.10(P06) ; off-sheet SOLENOID_CTR_7
SOLENOID_CTR_8: R477.2 U47.11(P07) ; off-sheet SOLENOID_CTR_8
SOLENOID_CTR_9: R201#2.2 U47.13(P10) ; off-sheet SOLENOID_CTR_9
SOLENOID_CTR_10: R202#2.2 U47.14(P11) ; off-sheet SOLENOID_CTR_10
SOLENOID_CTR_11: R491.2 U47.15(P12) ; off-sheet SOLENOID_CTR_11
SOLENOID_CTR_12: R492.2 U47.16(P13) ; off-sheet SOLENOID_CTR_12
SOLENOID_CTR_13: R497.2 U47.17(P14) ; off-sheet SOLENOID_CTR_13
SOLENOID_CTR_14: R498.2 U47.18(P15) ; off-sheet SOLENOID_CTR_14
SOLENOID_CTR_15: R499.2 U47.19(P16) ; off-sheet SOLENOID_CTR_15
SOLENOID_CTR_16: R500.2 U47.20(P17) ; off-sheet SOLENOID_CTR_16
NetD20_2: D20.2(A) DZ1.2(A)
NetD21_2: D21.2(A) DZ2.2(A)
NetD22_2: D22.2(A) DZ3.2(A)
NetD23_2: D23.2(A) DZ4.2(A)
NetD24_2: D24.2(A) DZ5.2(A)
NetD25_2: D25.2(A) DZ6.2(A)
NetD26_2: D26.2(A) DZ7.2(A)
NetD27_2: D27.2(A) DZ8.2(A)
NetD28_2: D28.2(A) DZ9.2(A)
NetD29_2: D29.2(A) DZ10.2(A)
NetD30_2: D30.2(A) DZ11.2(A)
NetD31_2: D31.2(A) DZ12.2(A)
NetD32_2: D32.2(A) DZ13.2(A)
NetD33_2: D33.2(A) DZ14.2(A)
NetD34_2: D34.2(A) DZ15.2(A)
NetD35_2: D35.2(A) DZ16.2(A)
NetDZ1_1: DZ1.1(K) Q11.3(D) R90.2
NetDZ2_1: DZ2.1(K) Q12.3(D) R92.2
NetDZ3_1: DZ3.1(K) Q13.3(D) R284.2
NetDZ4_1: DZ4.1(K) Q14.3(D) R334.2
NetDZ5_1: DZ5.1(K) Q15.3(D) R488.2
NetDZ6_1: DZ6.1(K) Q16.3(D) R505.2
NetDZ7_1: DZ7.1(K) Q17.3(D) R506.2
NetDZ8_1: DZ8.1(K) Q18.3(D) R507.2
NetDZ9_1: DZ9.1(K) Q19.3(D) R508.2
NetDZ10_1: DZ10.1(K) Q20.3(D) R509.2
NetDZ11_1: DZ11.1(K) Q21.3(D) R544.2
NetDZ12_1: DZ12.1(K) Q22.3(D) R545.2
NetDZ13_1: DZ13.1(K) Q23.3(D) R546.2
NetDZ14_1: DZ14.1(K) Q24.3(D) R547.2
NetDZ15_1: DZ15.1(K) Q25.3(D) R548.2
NetDZ16_1: DZ16.1(K) Q26.3(D) R549.2
NetQ11_1: Q11.1(G) R466.1 R470.2
NetQ12_1: Q12.1(G) R467.1 R471.2
NetQ13_1: Q13.1(G) R468.1 R472.2
NetQ14_1: Q14.1(G) R469.1 R473.2
NetQ15_1: Q15.1(G) R474.1 R478.2
NetQ16_1: Q16.1(G) R475.1 R479.2
NetQ17_1: Q17.1(G) R476.1 R480.2
NetQ18_1: Q18.1(G) R477.1 R481.2
NetQ19_1: Q19.1(G) R201#2.1 R493.2
NetQ20_1: Q20.1(G) R202#2.1 R494.2
NetQ21_1: Q21.1(G) R491.1 R495.2
NetQ22_1: Q22.1(G) R492.1 R496.2
NetQ23_1: Q23.1(G) R497.1 R501.2
NetQ24_1: Q24.1(G) R498.1 R502.2
NetQ25_1: Q25.1(G) R499.1 R503.2
NetQ26_1: Q26.1(G) R500.1 R504.2
NetR482_2: R482.2 U47.1(~{IN}T)
NetR483_2: R483.2 U47.3(~{RESET})

### Notes on the sheet
- Active High/ Pulled down
- Project:
- BEE-1012
- Sub-system:
- SATELLITE_EXP_CONTROLLER
- Design by:
- SANG HUYNH
- BAO BUI
- Sheet title:
- Sheet
- A3
- of
- Checked by:
- Approved by:
- VU PHAM
- Revision:
- Document No:
- Size:
- Date:

### Library data of the parts
C160#2 C208 = _CAP_C_2: CAP
D20-D35 = Diode SMD: Default Diode; Code - JEDEC: DO-214-AB; Value: 1N5007; Published: 8-Jun-2000; Revision: July-2002: Re-released for DXP Platform.; Publisher: Altium Limited
DZ1-DZ16 = DIODE Zener: Zenner
J29 J30 J32 J33 = Header 8x1_2M
Q11-Q26 = MOSFET_N: N-Channel 30 V 5.7A (Ta) 1.4W (Ta) Surface Mount SOT-23-3; MF: Alpha & Omega Semiconductor; SnapEDA_Link: https://www.snapeda.com/parts/AO3400A/Alpha/view-part/?ref=snap; Package: SOT-23 Alpha &amp; Omega Semiconductor Inc.; Value: *; MP: AO3400A; Check_prices: https://www.snapeda.com/parts/AO3400A/Alpha/view-part/?ref=eda
R90 R92 R201#2 R202#2 R284 R334 R466-R483 R488 R491-R509 R544-R549 = _RES_B_2: RES
U47 = IC_I2Cto16IO_TCA6416APWR

## Sheet MOUTING.SchDoc
size 420 x 297 mm; SheetNumber: 32; SheetTotal: 33
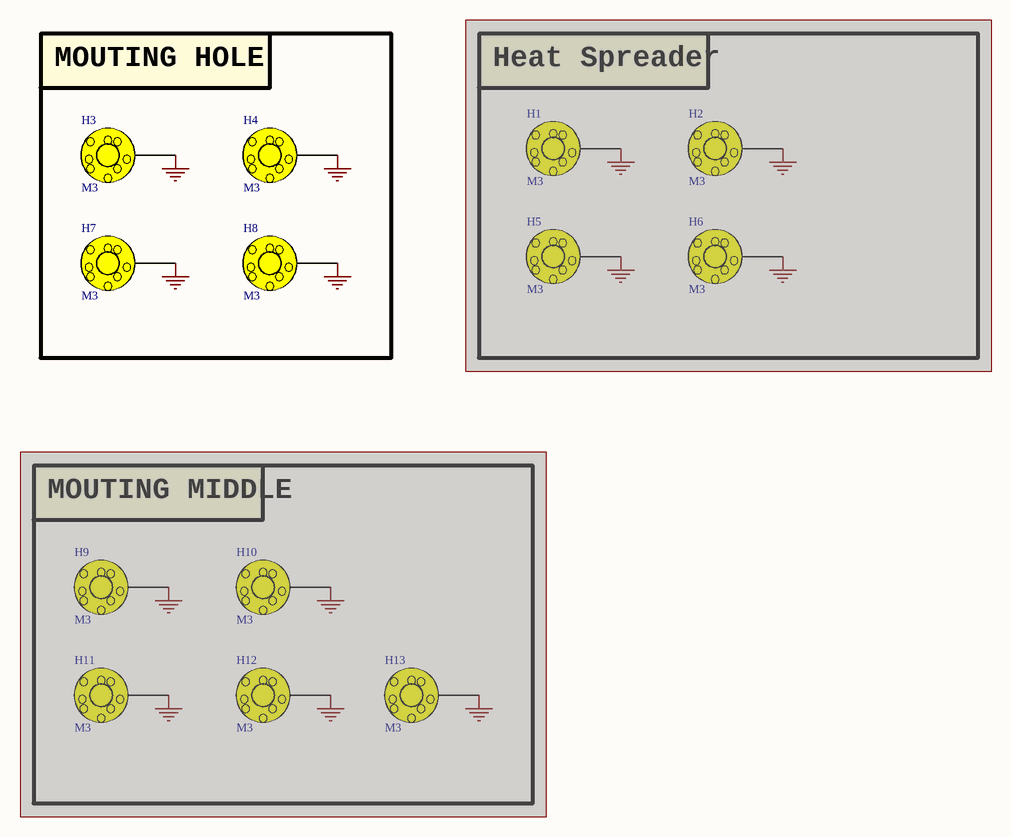
[diagram p36: MOUTING.SchDoc]

### Parts
H1  M3  [HEX-M3_NoVia]  (masked out: inside a compile mask, not in the netlist)
H2  M3  [HEX-M3_NoVia]  (masked out: inside a compile mask, not in the netlist)
H3  M3  [HEX-M3_NoVia]
H4  M3  [HEX-M3_NoVia]
H5  M3  [HEX-M3_NoVia]  (masked out: inside a compile mask, not in the netlist)
H6  M3  [HEX-M3_NoVia]  (masked out: inside a compile mask, not in the netlist)
H7  M3  [HEX-M3_NoVia]
H8  M3  [HEX-M3_NoVia]
H9  M3  [HEX-M3_NoVia]  (masked out: inside a compile mask, not in the netlist)
H10  M3  [HEX-M3_NoVia]  (masked out: inside a compile mask, not in the netlist)
H11  M3  [HEX-M3_NoVia]  (masked out: inside a compile mask, not in the netlist)
H12  M3  [HEX-M3_NoVia]  (masked out: inside a compile mask, not in the netlist)
H13  M3  [HEX-M3_NoVia]  (masked out: inside a compile mask, not in the netlist)

### Blocks framed on the sheet
MOUTING HOLE: H3 H4 H7 H8
Heat Spreader: H1 H2 H5 H6
MOUTING MIDDLE: H9-H13

### Nets
GND: H3.1 H4.1 H7.1 H8.1

### Notes on the sheet
- Project:
- BEE-1012
- Sub-system:
- SATELLITE_EXP_CONTROLLER
- Design by:
- SANG HUYNH
- BAO BUI
- Sheet title:
- Sheet
- A3
- of
- Checked by:
- Approved by:
- VU PHAM
- Revision:
- Document No:
- Size:
- Date:

### Library data of the parts
H1-H13 = HEX-M3

## Sheet ANA_SWITCH.SchDoc
size 420 x 297 mm; SheetNumber: 33; SheetTotal: 33
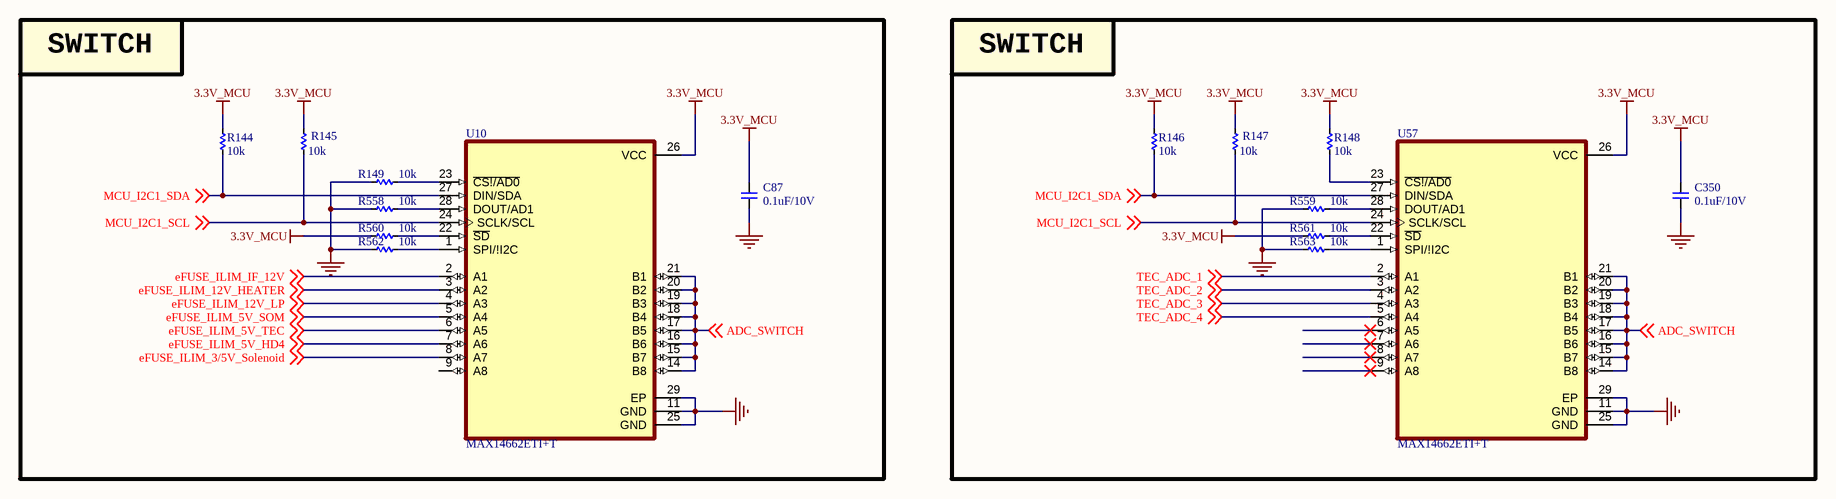
[diagram p37: ANA_SWITCH.SchDoc]

### Parts
(Parts that share a designator on the sheet are numbered #1, #2 ... from top to bottom, then left to right.)
C87#2  0.1uF/10V  [CAP_C_1005X50_L]
C350  0.1uF/10V  [CAP_C_1005X50_L]
R144#2  10k  [RES_C_1005x30_L]
R145#2  10k  [RES_C_1005x30_L]
R146#2  10k  [RES_C_1005x30_L]
R147#2  10k  [RES_C_1005x30_L]
R148#2  10k  [RES_C_1005x30_L]
R149#2  10k  [RES_C_1005x30_L]
R558  10k  [RES_C_1005x30_L]
R559  10k  [RES_C_1005x30_L]
R560  10k  [RES_C_1005x30_L]
R561  10k  [RES_C_1005x30_L]
R562  10k  [RES_C_1005x30_L]
R563  10k  [RES_C_1005x30_L]
U10#2  MAX14662ETI+T  [QFN40P400X400X80-29N]
U57  MAX14662ETI+T  [QFN40P400X400X80-29N]

### Blocks framed on the sheet
SWITCH: C87#2 R144#2 R145#2 R149#2 R558 R560 R562 U10#2
SWITCH: C350 R146#2 R147#2 R148#2 R559 R561 R563 U57

### Nets
3.3V_MCU: C87#2.2 C350.2 R144#2.2 R145#2.2 R146#2.2 R147#2.2 R148#2.1 R560.1 R561.1 U10#2.26(VCC) U57.26(VCC)
GND: C87#2.1 C350.1 R149#2.1 R558.1 R559.1 R562.1 R563.1 U10#2.11(GND) U10#2.25(GND) U10#2.29(EP) U57.11(GND) U57.25(GND) U57.29(EP)
ADC_SWITCH: U10#2.14(B8) U10#2.15(B7) U10#2.16(B6) U10#2.17(B5) U10#2.18(B4) U10#2.19(B3) U10#2.20(B2) U10#2.21(B1) U57.14(B8) U57.15(B7) U57.16(B6) U57.17(B5) U57.18(B4) U57.19(B3) U57.20(B2) U57.21(B1) ; off-sheet ADC_SWITCH
eFUSE_ILIM_3/5V_Solenoid: U10#2.8(A7) ; off-sheet eFUSE_ILIM_3/5V_Solenoid
eFUSE_ILIM_5V_HD4: U10#2.7(A6) ; off-sheet eFUSE_ILIM_5V_HD4
eFUSE_ILIM_5V_SOM: U10#2.5(A4) ; off-sheet eFUSE_ILIM_5V_SOM
eFUSE_ILIM_5V_TEC: U10#2.6(A5) ; off-sheet eFUSE_ILIM_5V_TEC
eFUSE_ILIM_12V_HEATER: U10#2.3(A2) ; off-sheet eFUSE_ILIM_12V_HEATER
eFUSE_ILIM_12V_LP: U10#2.4(A3) ; off-sheet eFUSE_ILIM_12V_LP
eFUSE_ILIM_IF_12V: U10#2.2(A1) ; off-sheet eFUSE_ILIM_IF_12V
MCU_I2C1_SCL: R145#2.1 R147#2.1 U10#2.24(SCLK/SCL) U57.24(SCLK/SCL) ; off-sheet MCU_I2C1_SCL
MCU_I2C1_SDA: R144#2.1 R146#2.1 U10#2.27(DIN/SDA) U57.27(DIN/SDA) ; off-sheet MCU_I2C1_SDA
TEC_ADC_1: U57.2(A1) ; off-sheet TEC_ADC_1
TEC_ADC_2: U57.3(A2) ; off-sheet TEC_ADC_2
TEC_ADC_3: U57.4(A3) ; off-sheet TEC_ADC_3
TEC_ADC_4: U57.5(A4) ; off-sheet TEC_ADC_4
NetR148#2_2: R148#2.2 U57.23(~{CS!/AD0})
NetR149#2_2: R149#2.2 U10#2.23(~{CS!/AD0})
NetR558_2: R558.2 U10#2.28(DOUT/AD1)
NetR559_2: R559.2 U57.28(DOUT/AD1)
NetR560_2: R560.2 U10#2.22(~{SD})
NetR561_2: R561.2 U57.22(~{SD})
NetR562_2: R562.2 U10#2.1(SPI/!I2C)
NetR563_2: R563.2 U57.1(SPI/!I2C)

Not connected (* = marked no-connect by the designer): U10#2 9(A8); U57 6(A5)* 7(A6)* 8(A7)* 9(A8)*

### Notes on the sheet
- Project:
- BEE-1012
- Sub-system:
- SATELLITE_EXP_CONTROLLER
- Design by:
- SANG HUYNH
- BAO BUI
- Sheet title:
- Sheet
- A3
- of
- Checked by:
- Approved by:
- VU PHAM
- Revision:
- Document No:
- Size:
- Date:

### Library data of the parts
C87#2 C350 = _CAP_C_2: CAP
R144#2 R145#2 R146#2 R147#2 R148#2 R149#2 R558-R563 = _RES_B_2: RES
U10#2 U57 = IC_SW_MAX14662ETI+T: 8 Circuit IC Switch 1:1 1Ohm 28-TQFN _4x4_; MF: Maxim Integrated; Package: TQFN-28 Maxim; Value: *; Price: None; MP: MAX14662ETI+T; SnapEDA_Link: https://www.snapeda.com/parts/MAX14662ETI%2BT/Maxim%20Integrated/view-part/546683/?ref=snap; Availability: Unavailable

## Nets that join several sheets
3.3_VBAT: 08_SAMA7G54-MPU (R332.1), 13_MRAM_RTC_WDT (C154#2.2 J26.1 U31.9)
3.3V_MCU: 05_CONNECTOR_OUT (8 pins), 06_POWER_1 (5 pins), 07_CAN (C184.1 C185.1 U41.3), 11_MCU (23 pins), 12_CONSOLE (C141#2.2 J19.1 R246.2 R247.2), 13_MRAM_RTC_WDT (26 pins), 14_NTC_TEMPSENSOR (22 pins), 16_TEC (12 pins), 17_FLOW_Sensor (34 pins), 17_I2C_Sensor_OnBoard (14 pins), 18_HD4_PUMP (C117.2 R197#2.1 R198#2.1 U17.1), 19_SOLEDNOID_2 (6 pins), ANA_SWITCH (11 pins)
3.3V_SAMA7: 05_CONNECTOR_OUT (R273.1 R274.1 R275.1 R276.1), 06_POWER_2 (5 pins), 07_CAN (6 pins), 08_SOM_USB_CARD (14 pins), 10_USB (8 pins), 12_CONSOLE (C140#2.2 J18.1 R244.2 R245.2), 13_MRAM_RTC_WDT (R287.2)
3V/5V_Solenoid: 06_POWER_4 (8 pins), 19_SOLEDNOID_1 (8 pins), 19_SOLEDNOID_2 (32 pins)
5V_HD4: 06_POWER_4 (8 pins), 18_HD4_PUMP (10 pins), 18_HD4_PUMP_2 (C122.2 U50.1)
5V_MCU: 06_POWER_1 (7 pins), 06_POWER_2 (6 pins), 06_POWER_3 (R411.1 R416.1), 06_POWER_4 (R424.1 R432.1), 06_POWER_5 (R128.1 R210.1), 19_SOLEDNOID_1 (R257.1 R260.1 R263.1 R266.1)
5V_PERI: 06_POWER_3 (10 pins), 06_POWER_4 (15 pins)
5V_SAMA7: 05_CONNECTOR_OUT (J24.11), 06_POWER_2 (10 pins), 08_SAMA7G54-PMIC (13 pins), 08_SAMA7G54-PIO (R533.1), 08_SOM_USB_CARD (JP2.1)
5V_TEC: 06_POWER_3 (8 pins), 16_TEC (20 pins)
12V_HEATER: 06_POWER_5 (8 pins), 15_HEATER (18 pins)
EXP_12V: 06_POWER_1 (10 pins), 06_POWER_3 (C159#2.2 U35.7), 06_POWER_5 (10 pins)
GND: 05_CONNECTOR_IN (16 pins), 05_CONNECTOR_OUT (13 pins), 06_POWER_1 (24 pins), 06_POWER_2 (17 pins), 06_POWER_3 (21 pins), 06_POWER_4 (33 pins), 06_POWER_5 (24 pins), 07_CAN (13 pins), 08_SAMA7G54-MPU (109 pins), 08_SAMA7G54-PMIC (29 pins), 08_SAMA7G54-PIO (9 pins), 08_SAMA7G54-DDR3 (84 pins), 08_SOM_USB_CARD (15 pins), 09_eMMC (29 pins), 10_USB (18 pins), 11_MCU (49 pins), 12_CONSOLE (8 pins), 13_MRAM_RTC_WDT (17 pins), 14_NTC_TEMPSENSOR (42 pins), 15_HEATER (22 pins), 16_TEC (54 pins), 17_FLOW_Sensor (30 pins), 17_I2C_Sensor_OnBoard (11 pins), 18_HD4_PUMP (14 pins), 18_HD4_PUMP_2 (5 pins), 19_SOLEDNOID_1 (22 pins), 19_SOLEDNOID_2 (44 pins), MOUTING (H3.1 H4.1 H7.1 H8.1), ANA_SWITCH (13 pins)
IF_12V: 05_CONNECTOR_IN (J1.1 J1.2 J1.3), 06_POWER_1 (5 pins)
LP_12V: 05_CONNECTOR_OUT (J21.1 J22.1 J23.1), 06_POWER_5 (8 pins)
VDD_3V3: 05_CONNECTOR_IN (7 pins), 08_SAMA7G54-MPU (6 pins), 08_SAMA7G54-PMIC (18 pins), 08_SAMA7G54-PIO (6 pins), 08_SOM_USB_CARD (C191.2 R455.2 U42.8), 09_eMMC (37 pins)
VDD_3V3_MPU: 08_SAMA7G54-MPU (18 pins), 08_SAMA7G54-PMIC (6 pins)
VDDBU: 08_SAMA7G54-MPU (C275.1 R306.2 R332.2 U29.P11), 08_SAMA7G54-PMIC (R339.2)
VDDCORE: 08_SAMA7G54-MPU (30 pins), 08_SAMA7G54-PMIC (R344.2 TP8.0)
VDDCPU: 08_SAMA7G54-MPU (11 pins), 08_SAMA7G54-PMIC (R349.2 TP10.0)
VDDIN33: 08_SAMA7G54-MPU (C273.1 C274.1 U29.H3), 08_SAMA7G54-PMIC (R351.2)
VDDIODDR: 08_SAMA7G54-PMIC (R354.2 TP16.0), 08_SAMA7G54-DDR3 (73 pins)
VDDUTMII: 08_SAMA7G54-MPU (11 pins), 08_SAMA7G54-PMIC (R352.2)
ADC_SWITCH: 11_MCU (R79.1), ANA_SWITCH (16 pins)
ADC_TEMP1: 11_MCU (R143.2), 14_NTC_TEMPSENSOR (C98.2 R174#2.2)
ADC_TEMP2: 11_MCU (R150.2), 14_NTC_TEMPSENSOR (C94.2 R168#2.2)
ADC_TEMP3: 11_MCU (R73.1), 14_NTC_TEMPSENSOR (C106.2 R180#2.2)
ADC_TEMP4: 11_MCU (R75.1), 14_NTC_TEMPSENSOR (C110.2 R186#2.2)
ADC_TEMP5: 11_MCU (R89.2), 14_NTC_TEMPSENSOR (C101.2 R175#2.2)
ADC_TEMP6: 11_MCU (R84.2), 14_NTC_TEMPSENSOR (C95.2 R169#2.2)
ADC_TEMP7: 11_MCU (R77.1), 14_NTC_TEMPSENSOR (C107.2 R181#2.2)
ADC_TEMP8: 11_MCU (R106.2), 14_NTC_TEMPSENSOR (C113.2 R187#2.2)
BMP390_INT: 11_MCU (R14.1), 17_I2C_Sensor_OnBoard (R290.2 U48.7)
CANRX1: 07_CAN (U41.4), 11_MCU (R82.2)
CANTX1: 07_CAN (U41.1), 11_MCU (R87.2)
eFUSE_ILIM_3/5V_Solenoid: 06_POWER_4 (R439.2 U38.9), ANA_SWITCH (U10#2.8)
eFUSE_ILIM_5V_HD4: 06_POWER_4 (R431.2 U37.9), ANA_SWITCH (U10#2.7)
eFUSE_ILIM_5V_SOM: 06_POWER_2 (R255.2 U24#2.9), ANA_SWITCH (U10#2.5)
eFUSE_ILIM_5V_TEC: 06_POWER_3 (R423.2 U36.9), ANA_SWITCH (U10#2.6)
eFUSE_ILIM_12V_HEATER: 06_POWER_5 (R341.2 U44.9), ANA_SWITCH (U10#2.3)
eFUSE_ILIM_12V_LP: 06_POWER_5 (R209.2 U43.9), ANA_SWITCH (U10#2.4)
eFUSE_ILIM_IF_12V: 06_POWER_1 (R6#2.2 U1#2.9), ANA_SWITCH (U10#2.2)
HEATER_PWM_1: 11_MCU (R52.2), 15_HEATER (R152#2.1)
HEATER_PWM_2: 11_MCU (R11.2), 15_HEATER (R159#2.1)
HEATER_PWM_3: 11_MCU (R13.2), 15_HEATER (R164#2.1)
HEATER_PWM_4: 11_MCU (R50.2), 15_HEATER (R166#2.1)
HEATER_PWM_5: 11_MCU (R74.2), 15_HEATER (R153#2.1)
HEATER_PWM_6: 11_MCU (R101.2), 15_HEATER (R160#2.1)
HEATER_PWM_7: 11_MCU (R70.2), 15_HEATER (R154#2.1)
HEATER_PWM_8: 11_MCU (R71.2), 15_HEATER (R158#2.1)
IF_MCU_SHUTDOWN: 05_CONNECTOR_IN (J1.7), 11_MCU (R312.1)
IF_SOM_USB_N: 05_CONNECTOR_IN (J2.8), 08_SAMA7G54-MPU (U29.B3)
IF_SOM_USB_P: 05_CONNECTOR_IN (J2.7), 08_SAMA7G54-MPU (U29.A3)
LASER_ADC_1: 05_CONNECTOR_OUT (J23.10), 11_MCU (R108.2)
LASER_ADC_2: 05_CONNECTOR_OUT (J23.11), 11_MCU (R278.2)
LASER_DAC_LATCH: 05_CONNECTOR_OUT (J23.7 R292.2), 11_MCU (R91.2)
LASER_SPI_nCS1: 05_CONNECTOR_OUT (J23.6 R291.2), 11_MCU (R59.2)
LASER_SW_EXT_CS: 05_CONNECTOR_OUT (J23.9 R294.2), 11_MCU (R37.2)
LASER_SW_INT_CS: 05_CONNECTOR_OUT (J23.8 R293.2), 11_MCU (R72.2)
LPM: 08_SAMA7G54-MPU (U29.R10), 08_SAMA7G54-PMIC (Q27.1 R331.1)
LSM6DSOX_INT: 11_MCU (R99.2), 17_I2C_Sensor_OnBoard (R296.2 U49.4)
MCP16502_HPM: 08_SAMA7G54-PMIC (R333.1), 08_SAMA7G54-PIO (R386.1 R533.2 R536.1)
MCU_CONSOLE_RX: 11_MCU (R49.1), 12_CONSOLE (J19.3 R247.1)
MCU_CONSOLE_TX: 11_MCU (R51.1), 12_CONSOLE (J19.2 R246.1)
MCU_FRAM_nCS: 11_MCU (R41.2), 13_MRAM_RTC_WDT (R450.1 U56.1)
MCU_HD4_I2C2_SCL: 11_MCU (R55.1), 18_HD4_PUMP (R197#2.2 U17.2), 19_SOLEDNOID_2 (U47.22)
MCU_HD4_I2C2_SDA: 11_MCU (R53.1), 18_HD4_PUMP (R198#2.2 U17.3), 19_SOLEDNOID_2 (U47.23)
MCU_HD4_I2C_EN: 11_MCU (R93.2), 18_HD4_PUMP (R203#2.1 U17.5)
MCU_I2C0_SCL: 11_MCU (R20.2), 17_FLOW_Sensor (7 pins)
MCU_I2C0_SDA: 11_MCU (R17.2), 17_FLOW_Sensor (7 pins)
MCU_I2C1_SCL: 11_MCU (R86.1), 13_MRAM_RTC_WDT (R399.1 U31.4), 17_I2C_Sensor_OnBoard (U48.2 U49.13), ANA_SWITCH (R145#2.1 R147#2.1 U10#2.24 U57.24)
MCU_I2C1_SDA: 11_MCU (R81.1), 13_MRAM_RTC_WDT (R400.1 U31.5), 17_I2C_Sensor_OnBoard (U48.4 U49.14), ANA_SWITCH (R144#2.1 R146#2.1 U10#2.27 U57.27)
MCU_MPD_DAC: 11_MCU (R96.1), 18_HD4_PUMP_2 (U50.2)
MCU_MPD_EN: 11_MCU (R22.1), 18_HD4_PUMP_2 (U50.3)
MCU_MPD_PWM: 11_MCU (R279.1), 18_HD4_PUMP_2 (U50.4)
MCU_MRAM_QSPI_CLK: 11_MCU (R34.2), 13_MRAM_RTC_WDT (U30.6)
MCU_MRAM_QSPI_IO0: 11_MCU (R32.2), 13_MRAM_RTC_WDT (U30.5)
MCU_MRAM_QSPI_IO1: 11_MCU (R30.2), 13_MRAM_RTC_WDT (U30.2)
MCU_MRAM_QSPI_IO2: 11_MCU (R38.2), 13_MRAM_RTC_WDT (U30.3)
MCU_MRAM_QSPI_IO3: 11_MCU (R60.1), 13_MRAM_RTC_WDT (U30.7)
MCU_PRAM_SPI1_nCS: 11_MCU (R105.2), 13_MRAM_RTC_WDT (R288.1 U32.2)
MCU_PRAM_SW_nEN: 11_MCU (R35.1), 13_MRAM_RTC_WDT (R405.1 U32.15)
MCU_RAM_QSPI_nCS: 11_MCU (R28.2), 13_MRAM_RTC_WDT (R396.1 U30.1)
MCU_RTC_CLKOUT: 11_MCU (R68.2), 13_MRAM_RTC_WDT (R397.1 U31.3)
MCU_RTC_INT: 11_MCU (R69.2), 13_MRAM_RTC_WDT (R398.1 U31.7)
MCU_SENSOR1_nIRQ: 11_MCU (R126.1), 17_FLOW_Sensor (J13.1)
MCU_SENSOR2_nIRQ: 11_MCU (R127.1), 17_FLOW_Sensor (J14.1)
MCU_SENSOR3_nIRQ: 11_MCU (R57.2), 17_FLOW_Sensor (J27.1)
MCU_SENSOR4_nIRQ: 11_MCU (R277.2), 17_FLOW_Sensor (J28.1)
MCU_SOL_1_IN1: 11_MCU (R15.2), 19_SOLEDNOID_1 (U25#2.3)
MCU_SOL_1_IN2: 11_MCU (R97.2), 19_SOLEDNOID_1 (U25#2.2)
MCU_SOL_2_IN1: 11_MCU (R40.1), 19_SOLEDNOID_1 (U28#2.3)
MCU_SOL_2_IN2: 11_MCU (R283.1), 19_SOLEDNOID_1 (U28#2.2)
MCU_SOL_3_IN1: 11_MCU (R46.2), 19_SOLEDNOID_1 (U27#2.3)
MCU_SOL_3_IN2: 11_MCU (R44.2), 19_SOLEDNOID_1 (U27#2.2)
MCU_SOL_4_IN1: 11_MCU (R48.2), 19_SOLEDNOID_1 (U26#2.3)
MCU_SOL_4_IN2: 11_MCU (R47.2), 19_SOLEDNOID_1 (U26#2.2)
MCU_SOM_GPIO_A: 08_SAMA7G54-PIO (R392.1), 11_MCU (R25.1)
MCU_SOM_GPIO_B: 08_SAMA7G54-PIO (R388.1), 11_MCU (R27.1)
MCU_SPI0_MISO: 05_CONNECTOR_OUT (J21.5 J23.4), 11_MCU (R42.1 R141.2)
MCU_SPI0_MOSI: 05_CONNECTOR_OUT (J21.4 J23.3), 11_MCU (R43.1)
MCU_SPI0_SCK: 05_CONNECTOR_OUT (J21.3 J23.5), 11_MCU (R45.1)
MCU_SPI1_MISO: 11_MCU (R103.2 R285.2), 13_MRAM_RTC_WDT (U32.14)
MCU_SPI1_MOSI: 11_MCU (R104.2), 13_MRAM_RTC_WDT (U32.11)
MCU_SPI1_SCK: 11_MCU (R102.2), 13_MRAM_RTC_WDT (U32.5)
MCU_UART0_RX_SOM_TX: 08_SAMA7G54-PIO (R528.1), 11_MCU (R24.2)
MCU_UART0_TX_SOM_RX: 08_SAMA7G54-PIO (R529.1), 11_MCU (R26.2)
MCU_USART_RXD2: 11_MCU (R131.1), 13_MRAM_RTC_WDT (U56.2), 16_TEC (U6.18 U7.18 U8.18 U9.18)
MCU_USART_SCK2: 11_MCU (R39.1), 13_MRAM_RTC_WDT (U56.6), 16_TEC (U6.16 U7.16 U8.16 U9.16)
MCU_USART_TXD2: 11_MCU (R133.1), 13_MRAM_RTC_WDT (U56.5), 16_TEC (U6.17 U7.17 U8.17 U9.17)
MIPI_CK_N: 05_CONNECTOR_OUT (J24.5), 08_SAMA7G54-MPU (U29.N20)
MIPI_CK_P: 05_CONNECTOR_OUT (J24.6), 08_SAMA7G54-MPU (U29.N21)
MIPI_D0_N: 05_CONNECTOR_OUT (J24.1), 08_SAMA7G54-MPU (U29.R18)
MIPI_D0_P: 05_CONNECTOR_OUT (J24.2), 08_SAMA7G54-MPU (U29.P18)
MIPI_D1_N: 05_CONNECTOR_OUT (J24.3), 08_SAMA7G54-MPU (U29.R20)
MIPI_D1_P: 05_CONNECTOR_OUT (J24.4), 08_SAMA7G54-MPU (U29.R21)
NetC300_2: 08_SAMA7G54-MPU (U29.J7), 08_SAMA7G54-PMIC (R340.1 U51.2), 08_SAMA7G54-PIO (C300.2 R535.1), 13_MRAM_RTC_WDT (R402.1)
NetQ27_3: 08_SAMA7G54-MPU (Y2.1), 08_SAMA7G54-PMIC (Q27.3 R350.2)
NetR286_2: 08_SAMA7G54-PMIC (U51.24), 11_MCU (R286.2)
NetR337_2: 08_SAMA7G54-PMIC (R337.2 U52.1), 08_SAMA7G54-PIO (R526.1)
NetR342_1: 08_SAMA7G54-PMIC (R342.1 U51.1), 08_SAMA7G54-PIO (U29.D19)
OBC_CANH: 05_CONNECTOR_IN (J1.9), 07_CAN (R440.1)
OBC_CANL: 05_CONNECTOR_IN (J1.8), 07_CAN (R444.1)
OBC_VS_SOM_I2C_SCL: 05_CONNECTOR_IN (J2.6), 08_SAMA7G54-PIO (R454.1)
OBC_VS_SOM_I2C_SDA: 05_CONNECTOR_IN (J2.5), 08_SAMA7G54-PIO (R452.1)
OBC_VS_SOM_SPI_SG_CS: 05_CONNECTOR_IN (J2.2), 08_SAMA7G54-PIO (R356.1)
OBC_VS_SOM_SPI_SG_MISO: 05_CONNECTOR_IN (J2.3), 08_SAMA7G54-PIO (R358.1)
OBC_VS_SOM_SPI_SG_MOSI: 05_CONNECTOR_IN (J2.1), 08_SAMA7G54-PIO (R361.1)
OBC_VS_SOM_SPI_SG_SCK: 05_CONNECTOR_IN (J2.4), 08_SAMA7G54-PIO (R486.1)
PHOTO_ADC_CONV: 05_CONNECTOR_OUT (J21.8 R271.2), 11_MCU (R36.2)
PHOTO_ADC_CS: 05_CONNECTOR_OUT (J21.7 R270.2), 11_MCU (R12.1)
PHOTO_ADC_EOC: 05_CONNECTOR_OUT (J21.9 R272.2), 11_MCU (R151.2)
PHOTO_SPI0_nCS2: 05_CONNECTOR_OUT (J21.6 R269.2), 11_MCU (R31.1)
POW_ONOFF_BUCK_PERI: 06_POWER_3 (R411.2 R414.1 U35.5), 11_MCU (R282.1)
POW_ONOFF_HD4: 06_POWER_4 (R424.2 R429.1 U37.1), 11_MCU (R18.1)
POW_ONOFF_HEATER: 06_POWER_5 (R210.2 R223.1 U44.1), 11_MCU (R281.1)
POW_ONOFF_LP: 06_POWER_5 (R128.2 R139.1 U43.1), 11_MCU (R23.1)
POW_ONOFF_Solenoid: 06_POWER_4 (R432.2 R437.1 U38.1), 11_MCU (R16.1)
POW_ONOFF_SOM: 06_POWER_2 (R248.2 R252.1 U24#2.1), 11_MCU (R21.1)
POW_ONOFF_TEC: 06_POWER_3 (R416.2 R421.1 U36.1), 11_MCU (R19.1)
RS422_DE: 05_CONNECTOR_IN (R305.2 U54.3), 08_SAMA7G54-PIO (R309.1)
RS422_~{RE}: 05_CONNECTOR_IN (R304.2 U54.2), 08_SAMA7G54-PIO (R308.1)
SAM7_FLEX1_I2C_SCL: 08_SAMA7G54-PMIC (R329.2 U51.6 U52.4), 08_SAMA7G54-PIO (R515.1)
SAM7_FLEX1_I2C_SDA: 08_SAMA7G54-PMIC (R330.2 U51.5 U52.5), 08_SAMA7G54-PIO (R514.1)
SD2_CLK: 08_SAMA7G54-PIO (R485.1), 08_SOM_USB_CARD (J17.P5 R231.1 U21.3)
SD2_CMD: 08_SAMA7G54-PIO (R459.1), 08_SOM_USB_CARD (J17.P3 R232.1 U22#2.1)
SD2_DATA0: 08_SAMA7G54-PIO (R487.1), 08_SOM_USB_CARD (J17.P7 R227.1 U21.4)
SD2_DATA1: 08_SAMA7G54-PIO (R510.1), 08_SOM_USB_CARD (J17.P8 R228.1 U21.6)
SD2_DATA2: 08_SAMA7G54-PIO (R511.1), 08_SOM_USB_CARD (J17.P1 R229.1 U22#2.4)
SD2_DATA3: 08_SAMA7G54-PIO (R512.1), 08_SOM_USB_CARD (J17.P2 R230.1 U22#2.6)
SD2_nCD: 08_SAMA7G54-PIO (R513.1), 08_SOM_USB_CARD (J17.P9 R226.1)
SENSOR1_EN: 11_MCU (R76.2), 17_FLOW_Sensor (R213.1 U18.5)
SENSOR2_EN: 11_MCU (R78.2), 17_FLOW_Sensor (R217.1 U19.5)
SENSOR3_EN: 11_MCU (R54.2), 17_FLOW_Sensor (R462.1 U45.5)
SENSOR4_EN: 11_MCU (R56.2), 17_FLOW_Sensor (R465.1 U46.5)
SENSOR5_EN: 11_MCU (R80.2), 17_FLOW_Sensor (R225.1 U20.5)
SHDN: 08_SAMA7G54-MPU (U29.R9), 08_SAMA7G54-PMIC (R335.1)
SOM_CAM_I2C_SCL: 05_CONNECTOR_OUT (J24.9), 08_SAMA7G54-PIO (R520.1)
SOM_CAM_I2C_SDA: 05_CONNECTOR_OUT (J24.8), 08_SAMA7G54-PIO (R522.1)
SOM_CANRX0: 07_CAN (U39.4), 08_SAMA7G54-PIO (R519.1)
SOM_CANRX1: 07_CAN (U40.4), 08_SAMA7G54-PIO (R523.1)
SOM_CANTX0: 07_CAN (U39.1), 08_SAMA7G54-PIO (R517.1)
SOM_CANTX1: 07_CAN (U40.1), 08_SAMA7G54-PIO (R521.1)
SOM_CONSOLE_RX: 08_SAMA7G54-PIO (R518.1), 12_CONSOLE (J18.3 R245.1)
SOM_CONSOLE_TX: 08_SAMA7G54-PIO (R516.1), 12_CONSOLE (J18.2 R244.1)
SOM_EMMC_nRST: 08_SAMA7G54-PIO (R360.1), 09_eMMC (R243.1 U23#2.M5)
SOM_MRAM_QSPI_CLK: 08_SAMA7G54-PIO (R385.1), 08_SOM_USB_CARD (U42.6)
SOM_MRAM_QSPI_IO0: 08_SAMA7G54-PIO (R383.1), 08_SOM_USB_CARD (U42.5)
SOM_MRAM_QSPI_IO1: 08_SAMA7G54-PIO (R382.1), 08_SOM_USB_CARD (U42.2)
SOM_MRAM_QSPI_IO2: 08_SAMA7G54-PIO (R380.1), 08_SOM_USB_CARD (U42.3)
SOM_MRAM_QSPI_IO3: 08_SAMA7G54-PIO (R378.1), 08_SOM_USB_CARD (U42.7)
SOM_PHOTO_ADC_CONV: 05_CONNECTOR_OUT (J22.8 R275.2), 08_SAMA7G54-PIO (R387.1)
SOM_PHOTO_ADC_EOC: 05_CONNECTOR_OUT (J22.9 R276.2), 08_SAMA7G54-PIO (R524.1)
SOM_PHOTO_ADC_nCS: 05_CONNECTOR_OUT (J22.7 R274.2), 08_SAMA7G54-PIO (R370.1)
SOM_PHOTO_SPI_MISO: 05_CONNECTOR_OUT (J22.5), 08_SAMA7G54-PIO (R364.1)
SOM_PHOTO_SPI_MOSI: 05_CONNECTOR_OUT (J22.4), 08_SAMA7G54-PIO (R362.1)
SOM_PHOTO_SPI_SCK: 05_CONNECTOR_OUT (J22.3), 08_SAMA7G54-PIO (R367.1)
SOM_PHOTO_SW_nCS: 05_CONNECTOR_OUT (J22.6 R273.2), 08_SAMA7G54-PIO (R359.1)
SOM_PRAM_nCS: 08_SAMA7G54-PIO (R456.1), 13_MRAM_RTC_WDT (R287.1 U32.3)
SOM_PRAM_SPI_MISO: 08_SAMA7G54-PIO (R458.1), 13_MRAM_RTC_WDT (U32.13)
SOM_PRAM_SPI_MOSI: 08_SAMA7G54-PIO (R457.1), 13_MRAM_RTC_WDT (U32.10)
SOM_PRAM_SPI_SCK: 08_SAMA7G54-PIO (R395.1), 13_MRAM_RTC_WDT (U32.6)
SOM_RAM_QSPI_nCS: 08_SAMA7G54-PIO (R384.1), 08_SOM_USB_CARD (R455.1 U42.1)
SOM_RS422_RX: 05_CONNECTOR_IN (U54.1), 08_SAMA7G54-PIO (R527.1)
SOM_RS422_TX: 05_CONNECTOR_IN (U54.4), 08_SAMA7G54-PIO (R525.1)
SOM_SDMMC0_OUT_CK: 08_SAMA7G54-PIO (R355.1), 09_eMMC (R242.1 U23#2.P6)
SOM_SDMMC0_OUT_CMD: 08_SAMA7G54-PIO (R357.1), 09_eMMC (R241.1 U23#2.P5)
SOM_SDMMC0_OUT_D0: 08_SAMA7G54-PIO (R363.1), 09_eMMC (R240.1 U23#2.K2)
SOM_SDMMC0_OUT_D1: 08_SAMA7G54-PIO (R365.1), 09_eMMC (R239.1 U23#2.N2)
SOM_SDMMC0_OUT_D2: 08_SAMA7G54-PIO (R368.1), 09_eMMC (R238.1 U23#2.K3)
SOM_SDMMC0_OUT_D3: 08_SAMA7G54-PIO (R371.1), 09_eMMC (R237.1 U23#2.N3)
SOM_SDMMC0_OUT_D4: 08_SAMA7G54-PIO (R373.1), 09_eMMC (R236.1 U23#2.N8)
SOM_SDMMC0_OUT_D5: 08_SAMA7G54-PIO (R375.1), 09_eMMC (R235.1 U23#2.K8)
SOM_SDMMC0_OUT_D6: 08_SAMA7G54-PIO (R377.1), 09_eMMC (R234.1 U23#2.N9)
SOM_SDMMC0_OUT_D7: 08_SAMA7G54-PIO (R379.1), 09_eMMC (R233.1 U23#2.K9)
SOM_SDMMC0_OUT_DS: 08_SAMA7G54-PIO (R381.1), 09_eMMC (U23#2.K5)
SOM_USB_LED_1: 08_SAMA7G54-PIO (R389.1), 10_USB (R113.1)
SOM_USB_LED_2: 08_SAMA7G54-PIO (R530.1), 10_USB (R118.1)
SOM_USB_PWR_EN1: 08_SAMA7G54-PIO (R374.1), 10_USB (R123.1 U5.1)
SOM_USB_PWR_EN2: 08_SAMA7G54-PIO (R376.1), 10_USB (R122.1 U5.4)
SOM_USB_SW_nOE: 08_SAMA7G54-PIO (R366.1), 10_USB (R111.2 U4.15)
SOM_USB_SW_SEL0: 08_SAMA7G54-PIO (R369.1), 10_USB (R116.1 U4.6)
SOM_USB_SW_SEL1: 08_SAMA7G54-PIO (R372.1), 10_USB (R115.1 U4.5)
TEC_ADC_1: 16_TEC (U6.20), ANA_SWITCH (U57.2)
TEC_ADC_2: 16_TEC (U8.20), ANA_SWITCH (U57.3)
TEC_ADC_3: 16_TEC (U7.20), ANA_SWITCH (U57.4)
TEC_ADC_4: 16_TEC (U9.20), ANA_SWITCH (U57.5)
TEC_nCS_1: 11_MCU (R95.2), 16_TEC (R124.2 U6.15)
TEC_nCS_2: 11_MCU (R98.2), 16_TEC (R134.2 U8.15)
TEC_nCS_3: 11_MCU (R100.2), 16_TEC (R125.2 U7.15)
TEC_nCS_4: 11_MCU (R29.1), 16_TEC (R135.2 U9.15)
TEC_SWEN_1: 11_MCU (R58.2), 16_TEC (R130.1 U6.13)
TEC_SWEN_2: 11_MCU (R33.1), 16_TEC (R140.1 U8.13)
TEC_SWEN_3: 11_MCU (R64.2), 16_TEC (R132.1 U7.13)
TEC_SWEN_4: 11_MCU (R66.2), 16_TEC (R142.1 U9.13)
TEMP _SENSOR: 11_MCU (R107.2), 14_NTC_TEMPSENSOR (U15.2)
USBB_N: 08_SAMA7G54-MPU (U29.B4), 08_SOM_USB_CARD (J16.2)
USBB_P: 08_SAMA7G54-MPU (U29.A4), 08_SOM_USB_CARD (J16.3)
USBC_N: 08_SAMA7G54-MPU (U29.B6), 10_USB (U4.3)
USBC_P: 08_SAMA7G54-MPU (U29.A6), 10_USB (U4.2)
WD_DONE: 11_MCU (R65.1), 13_MRAM_RTC_WDT (U34.4)
WD_nRESET: 11_MCU (R62.2), 13_MRAM_RTC_WDT (R402.2 R408.1)
WD_WAKE: 11_MCU (R67.1), 13_MRAM_RTC_WDT (U34.5)
WKUP: 08_SAMA7G54-MPU (U29.AA15), 08_SAMA7G54-PMIC (R339.1 U51.7)